# Altium project Platforma.PrjPcb
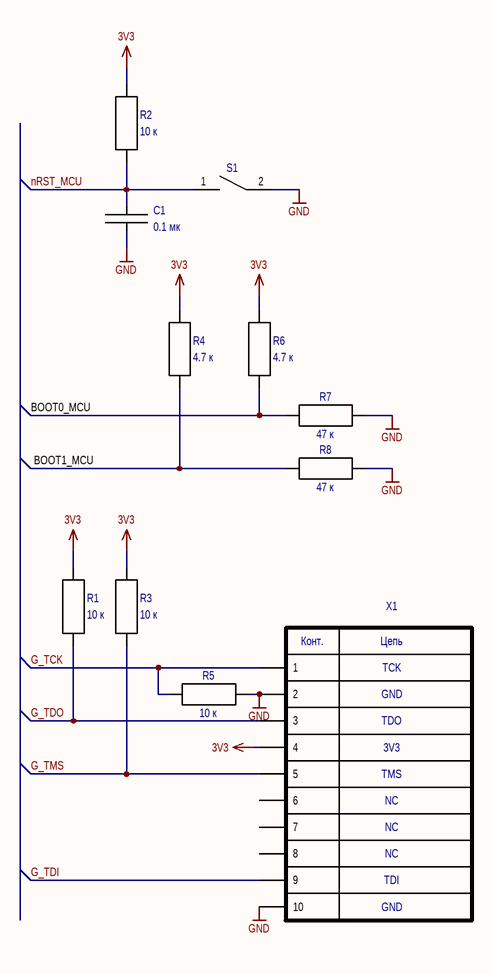
[diagram p0: служебный.SchDoc]
6 sheets, 181 parts. Net scope: global (net labels, ports and power ports of the same name join across sheets).
Board file: platforma.PcbDoc
Sheets:
  служебный.SchDoc
  мезанин.SchDoc
  GPIO_mcu_plis.SchDoc
  периферия.SchDoc
  программатор_мк.SchDoc
  программатор_ПЛИС.SchDoc

## Sheet служебный.SchDoc
size 420 x 297 mm; SheetNumber: 1; SheetTotal: 6

### Parts
C1  value 0.1 мк  (hidden comment: 0.1 мкФ ±* * * *, *)
R1  value 10 к
R2  value 10 к
R3  value 10 к
R4  value 4.7 к
R5  value 10 к
R6  value 4.7 к
R7  value 47 к
R8  value 47 к
S1  Тактильный переключатель KLS7-TS6604-4.3-180-B KLS  (value not drawn)
X1  1: GND  2: 3V3  4: TMS  6: TCK  8: TDO  10: TDI  12: NC  (hidden comment: KONT_POLE_JTAG14)

### Nets
3V3: R1.1 R2.1 R3.1 R4.1 R6.1 X1.4
GND: C1.1 R5.2 R7.2 R8.2 S1.2 X1.2 X1.10
BOOT0_MCU: R6.2 R7.1
BOOT1_MCU: R4.2 R8.1
G_TCK: R5.1 X1.1
G_TDI: X1.9
G_TDO: R1.2 X1.3
G_TMS: R3.2 X1.5
nRST_MCU: C1.2 R2.2 S1.1

Not connected (* = marked no-connect by the designer): X1 6 7 8

### Notes on the sheet
- Перв.примен.
- Справ. №
- Подп. и дата
- Инв.№ дубл.
- Взам. инв. №
- Изм.
- Лист
- № докум.
- Подп.
- Дата
- Лит.
- Масса
- Масштаб
- Пров.
- Т.контр
- Разраб.
- Схема электрическая принципиальная
- 1
- Листов
- Инв № подл.
- Н.контр.
- Утв.
- Копировал
- Формат А3
- (in symbol KONT_POLE_JTAG10) Конт.; Цепь

### Library data of the parts
C1 = C: Company: *; PartNumber: *; Tolerance: *; Voltage: *; Type: *; Package: *
R1-R8 = R_1: Company: *; PartNumber: *; Package: *; Tolerance: *
S1 = BTN: Company: KLS; PartNumber: KLS7-TS6604-4.3-180-B
X1 = KONT_POLE_JTAG10: 14: NC; 5: NC; 9: GND

## Sheet мезанин.SchDoc
size 420 x 297 mm; SheetNumber: 2; SheetTotal: 6
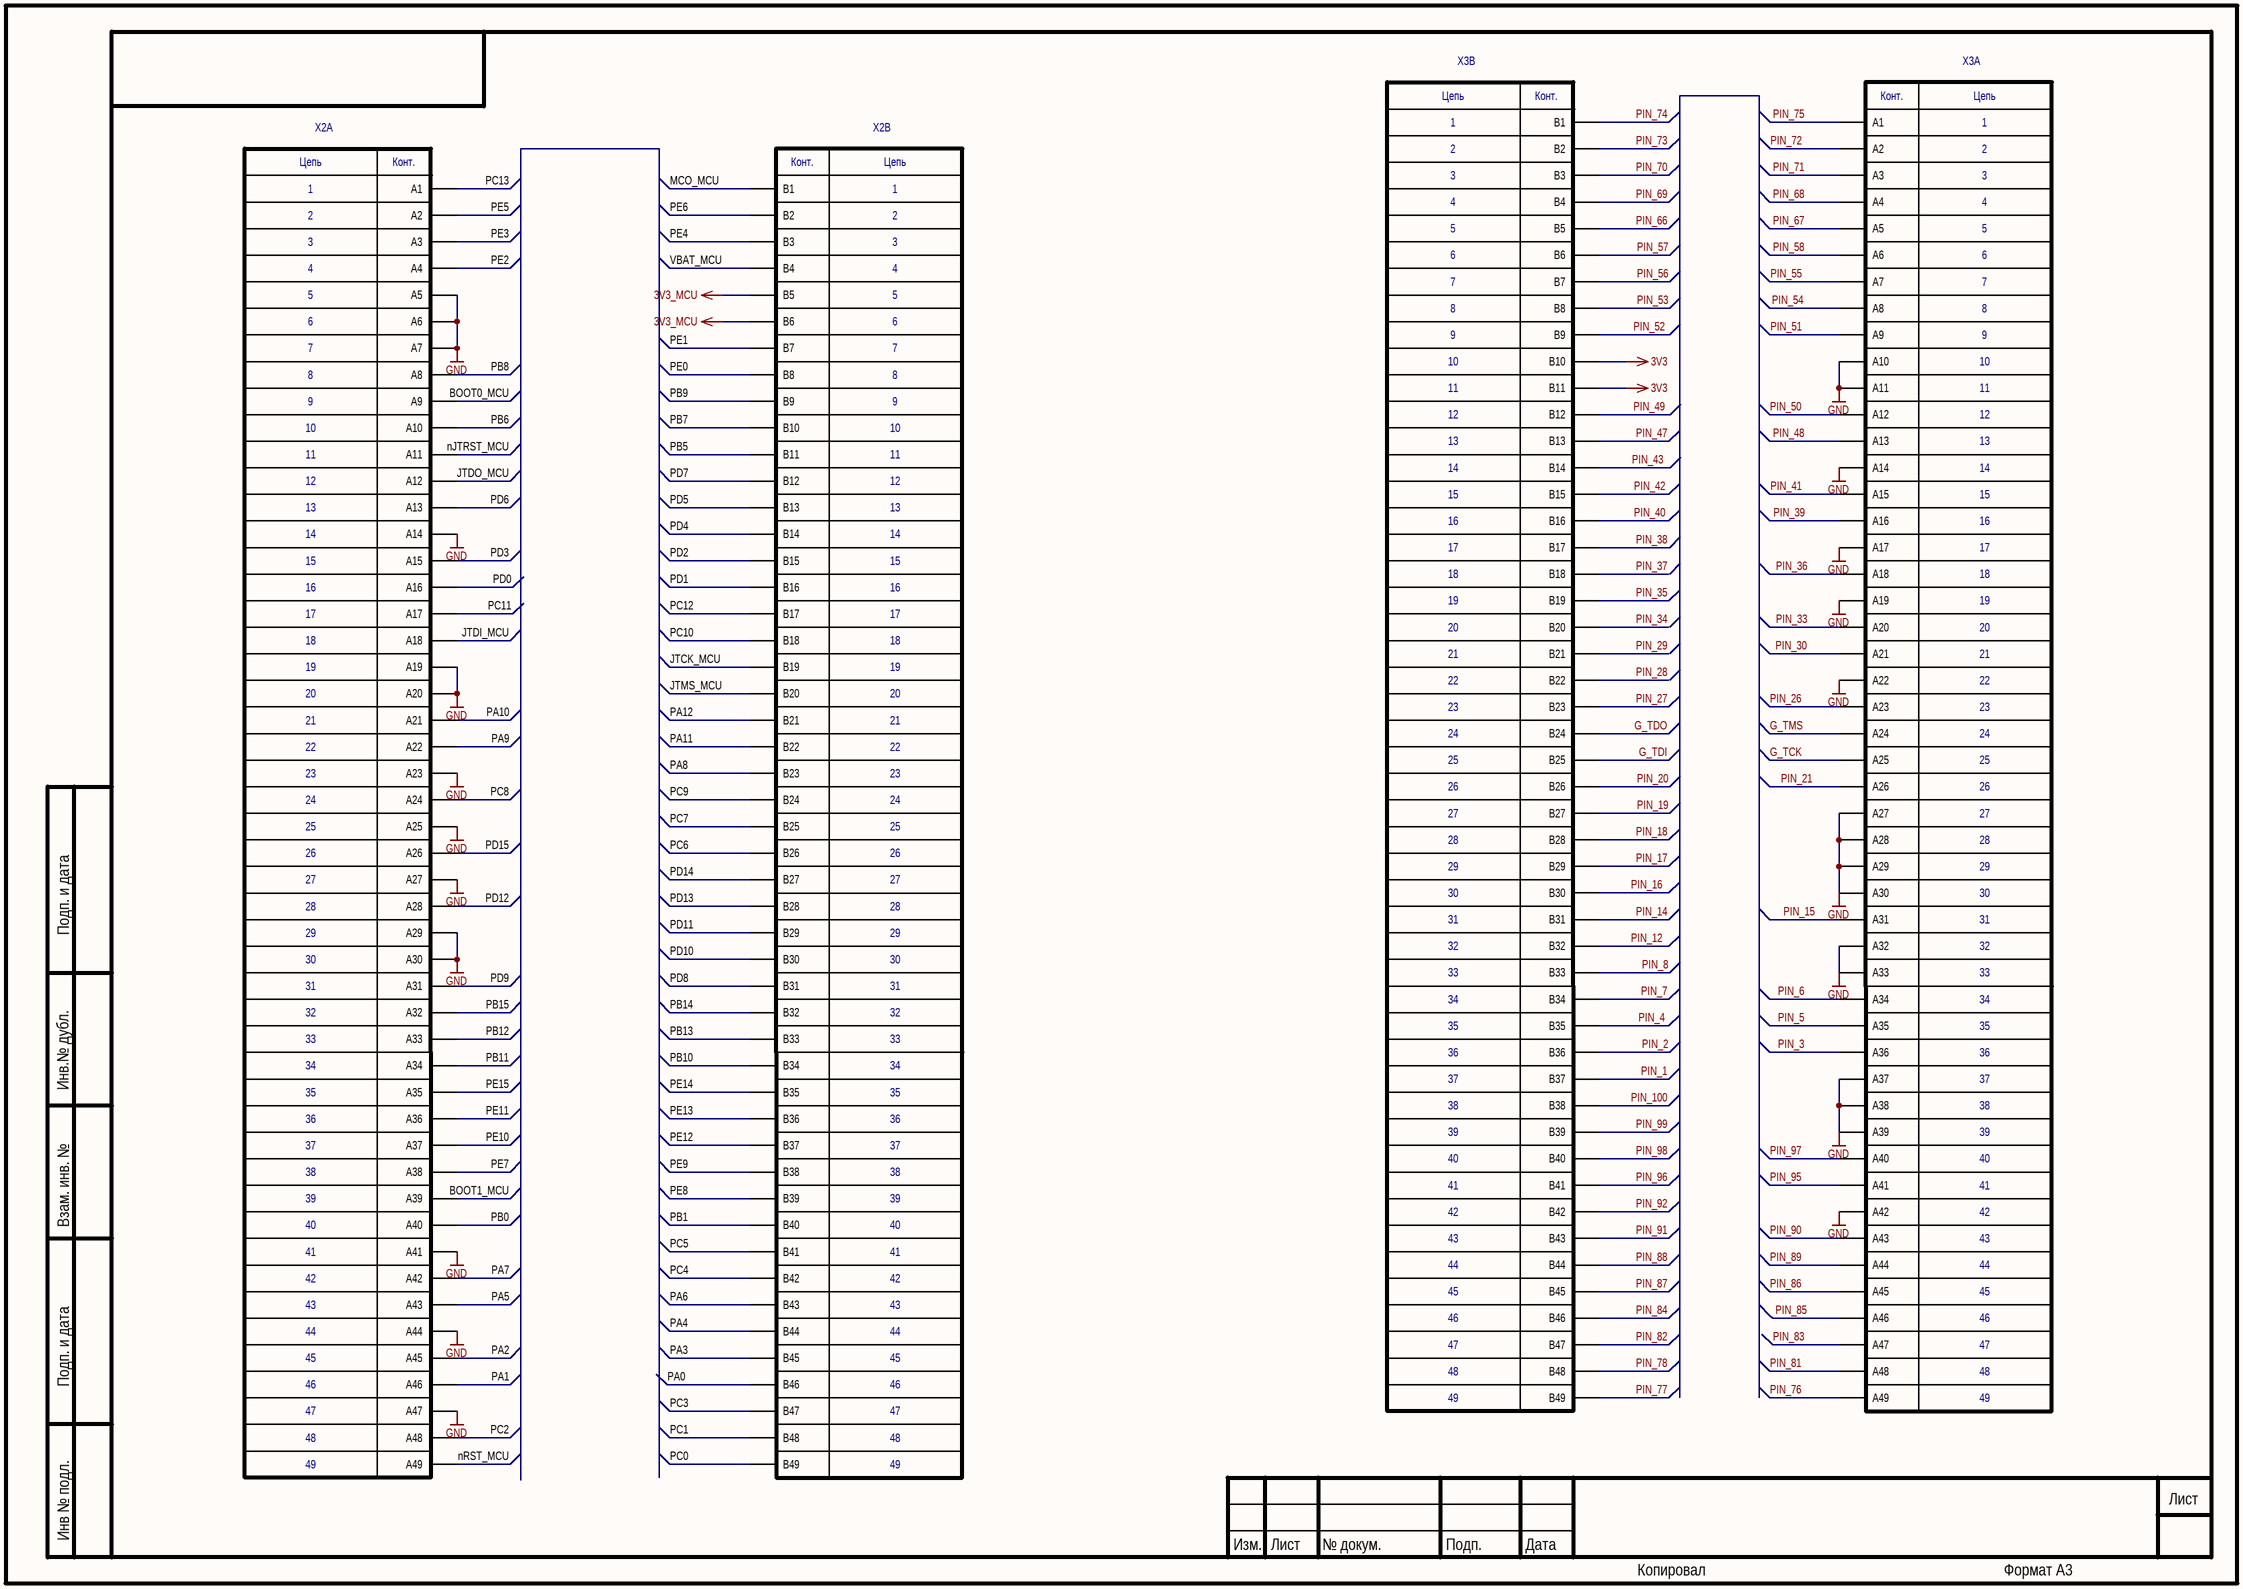
[diagram p1: мезанин.SchDoc]

### Parts
X2  KONT_POLE_MEZ  [3113-112T]  (value not drawn)  (parts A,B of 2)
X3  KONT_POLE_MEZ  [3113-112T]  (value not drawn)  (parts A,B of 2)

### Nets
3V3: X3.B10 X3.B11
3V3_MCU: X2.B5 X2.B6
GND: X2.A5 X2.A6 X2.A7 X2.A14 X2.A19 X2.A20 X2.A23 X2.A25 X2.A27 X2.A29 X2.A30 X2.A41 X2.A44 X2.A47 X3.A10 X3.A11 X3.A14 X3.A17 X3.A19 X3.A22 X3.A27 X3.A28 X3.A29 X3.A30 X3.A32 X3.A33 X3.A37 X3.A38 X3.A39 X3.A42
BOOT0_MCU: X2.A9
BOOT1_MCU: X2.A39
G_TCK: X3.A25
G_TDI: X3.B25
G_TDO: X3.B24
G_TMS: X3.A24
JTCK_MCU: X2.B19
JTDI_MCU: X2.A18
JTDO_MCU: X2.A12
JTMS_MCU: X2.B20
MCO_MCU: X2.B1
nJTRST_MCU: X2.A11
nRST_MCU: X2.A49
PA0: X2.B46
PA1: X2.A46
PA2: X2.A45
PA3: X2.B45
PA4: X2.B44
PA5: X2.A43
PA6: X2.B43
PA7: X2.A42
PA8: X2.B23
PA9: X2.A22
PA10: X2.A21
PA11: X2.B22
PA12: X2.B21
PB0: X2.A40
PB1: X2.B40
PB5: X2.B11
PB6: X2.A10
PB7: X2.B10
PB8: X2.A8
PB9: X2.B9
PB10: X2.B34
PB11: X2.A34
PB12: X2.A33
PB13: X2.B33
PB14: X2.B32
PB15: X2.A32
PC0: X2.B49
PC1: X2.B48
PC2: X2.A48
PC3: X2.B47
PC4: X2.B42
PC5: X2.B41
PC6: X2.B26
PC7: X2.B25
PC8: X2.A24
PC9: X2.B24
PC10: X2.B18
PC11: X2.A17
PC12: X2.B17
PC13: X2.A1
PD0: X2.A16
PD1: X2.B16
PD2: X2.B15
PD3: X2.A15
PD4: X2.B14
PD5: X2.B13
PD6: X2.A13
PD7: X2.B12
PD8: X2.B31
PD9: X2.A31
PD10: X2.B30
PD11: X2.B29
PD12: X2.A28
PD13: X2.B28
PD14: X2.B27
PD15: X2.A26
PE0: X2.B8
PE1: X2.B7
PE2: X2.A4
PE3: X2.A3
PE4: X2.B3
PE5: X2.A2
PE6: X2.B2
PE7: X2.A38
PE8: X2.B39
PE9: X2.B38
PE10: X2.A37
PE11: X2.A36
PE12: X2.B37
PE13: X2.B36
PE14: X2.B35
PE15: X2.A35
PIN_1: X3.B37
PIN_2: X3.B36
PIN_3: X3.A36
PIN_4: X3.B35
PIN_5: X3.A35
PIN_6: X3.A34
PIN_7: X3.B34
PIN_8: X3.B33
PIN_12: X3.B32
PIN_14: X3.B31
PIN_15: X3.A31
PIN_16: X3.B30
PIN_17: X3.B29
PIN_18: X3.B28
PIN_19: X3.B27
PIN_20: X3.B26
PIN_21: X3.A26
PIN_26: X3.A23
PIN_27: X3.B23
PIN_28: X3.B22
PIN_29: X3.B21
PIN_30: X3.A21
PIN_33: X3.A20
PIN_34: X3.B20
PIN_35: X3.B19
PIN_36: X3.A18
PIN_37: X3.B18
PIN_38: X3.B17
PIN_39: X3.A16
PIN_40: X3.B16
PIN_41: X3.A15
PIN_42: X3.B15
PIN_43: X3.B14
PIN_47: X3.B13
PIN_48: X3.A13
PIN_49: X3.B12
PIN_50: X3.A12
PIN_51: X3.A9
PIN_52: X3.B9
PIN_53: X3.B8
PIN_54: X3.A8
PIN_55: X3.A7
PIN_56: X3.B7
PIN_57: X3.B6
PIN_58: X3.A6
PIN_66: X3.B5
PIN_67: X3.A5
PIN_68: X3.A4
PIN_69: X3.B4
PIN_70: X3.B3
PIN_71: X3.A3
PIN_72: X3.A2
PIN_73: X3.B2
PIN_74: X3.B1
PIN_75: X3.A1
PIN_76: X3.A49
PIN_77: X3.B49
PIN_78: X3.B48
PIN_81: X3.A48
PIN_82: X3.B47
PIN_83: X3.A47
PIN_84: X3.B46
PIN_85: X3.A46
PIN_86: X3.A45
PIN_87: X3.B45
PIN_88: X3.B44
PIN_89: X3.A44
PIN_90: X3.A43
PIN_91: X3.B43
PIN_92: X3.B42
PIN_95: X3.A41
PIN_96: X3.B41
PIN_97: X3.A40
PIN_98: X3.B40
PIN_99: X3.B39
PIN_100: X3.B38
VBAT_MCU: X2.B4

### Notes on the sheet
- Подп. и дата
- Инв.№ дубл.
- Взам. инв. №
- Инв № подл.
- Изм.
- Лист
- № докум.
- Подп.
- Дата
- Копировал
- Формат А3
- (in symbol 3113-112T, part A) Конт.; Цепь; 1; 2; 3; 4; 5; 6; 7; 8; 9; 10; 11; 12; 13; 14; 15; 16; 17; 18; 19; 20; 21; 22; 23; 24; 25; 26; 27; 28; 29; 30; 31; 32; 33; 34; 35; 36; 37; 38; 39; 40; 41; 42; 43; 44; 45; 46; 47; 48; 49
- (in symbol 3113-112T, part B) Цепь; Конт.; 1; 2; 3; 4; 5; 6; 7; 8; 9; 10; 11; 12; 13; 14; 15; 16; 17; 18; 19; 20; 21; 22; 23; 24; 25; 26; 27; 28; 29; 30; 31; 32; 33; 34; 35; 36; 37; 38; 39; 40; 41; 42; 43; 44; 45; 46; 47; 48; 49

### Library data of the parts
X2 X3 = 3113-112T

## Sheet GPIO_mcu_plis.SchDoc
size 420 x 297 mm; SheetNumber: 3; SheetTotal: 6
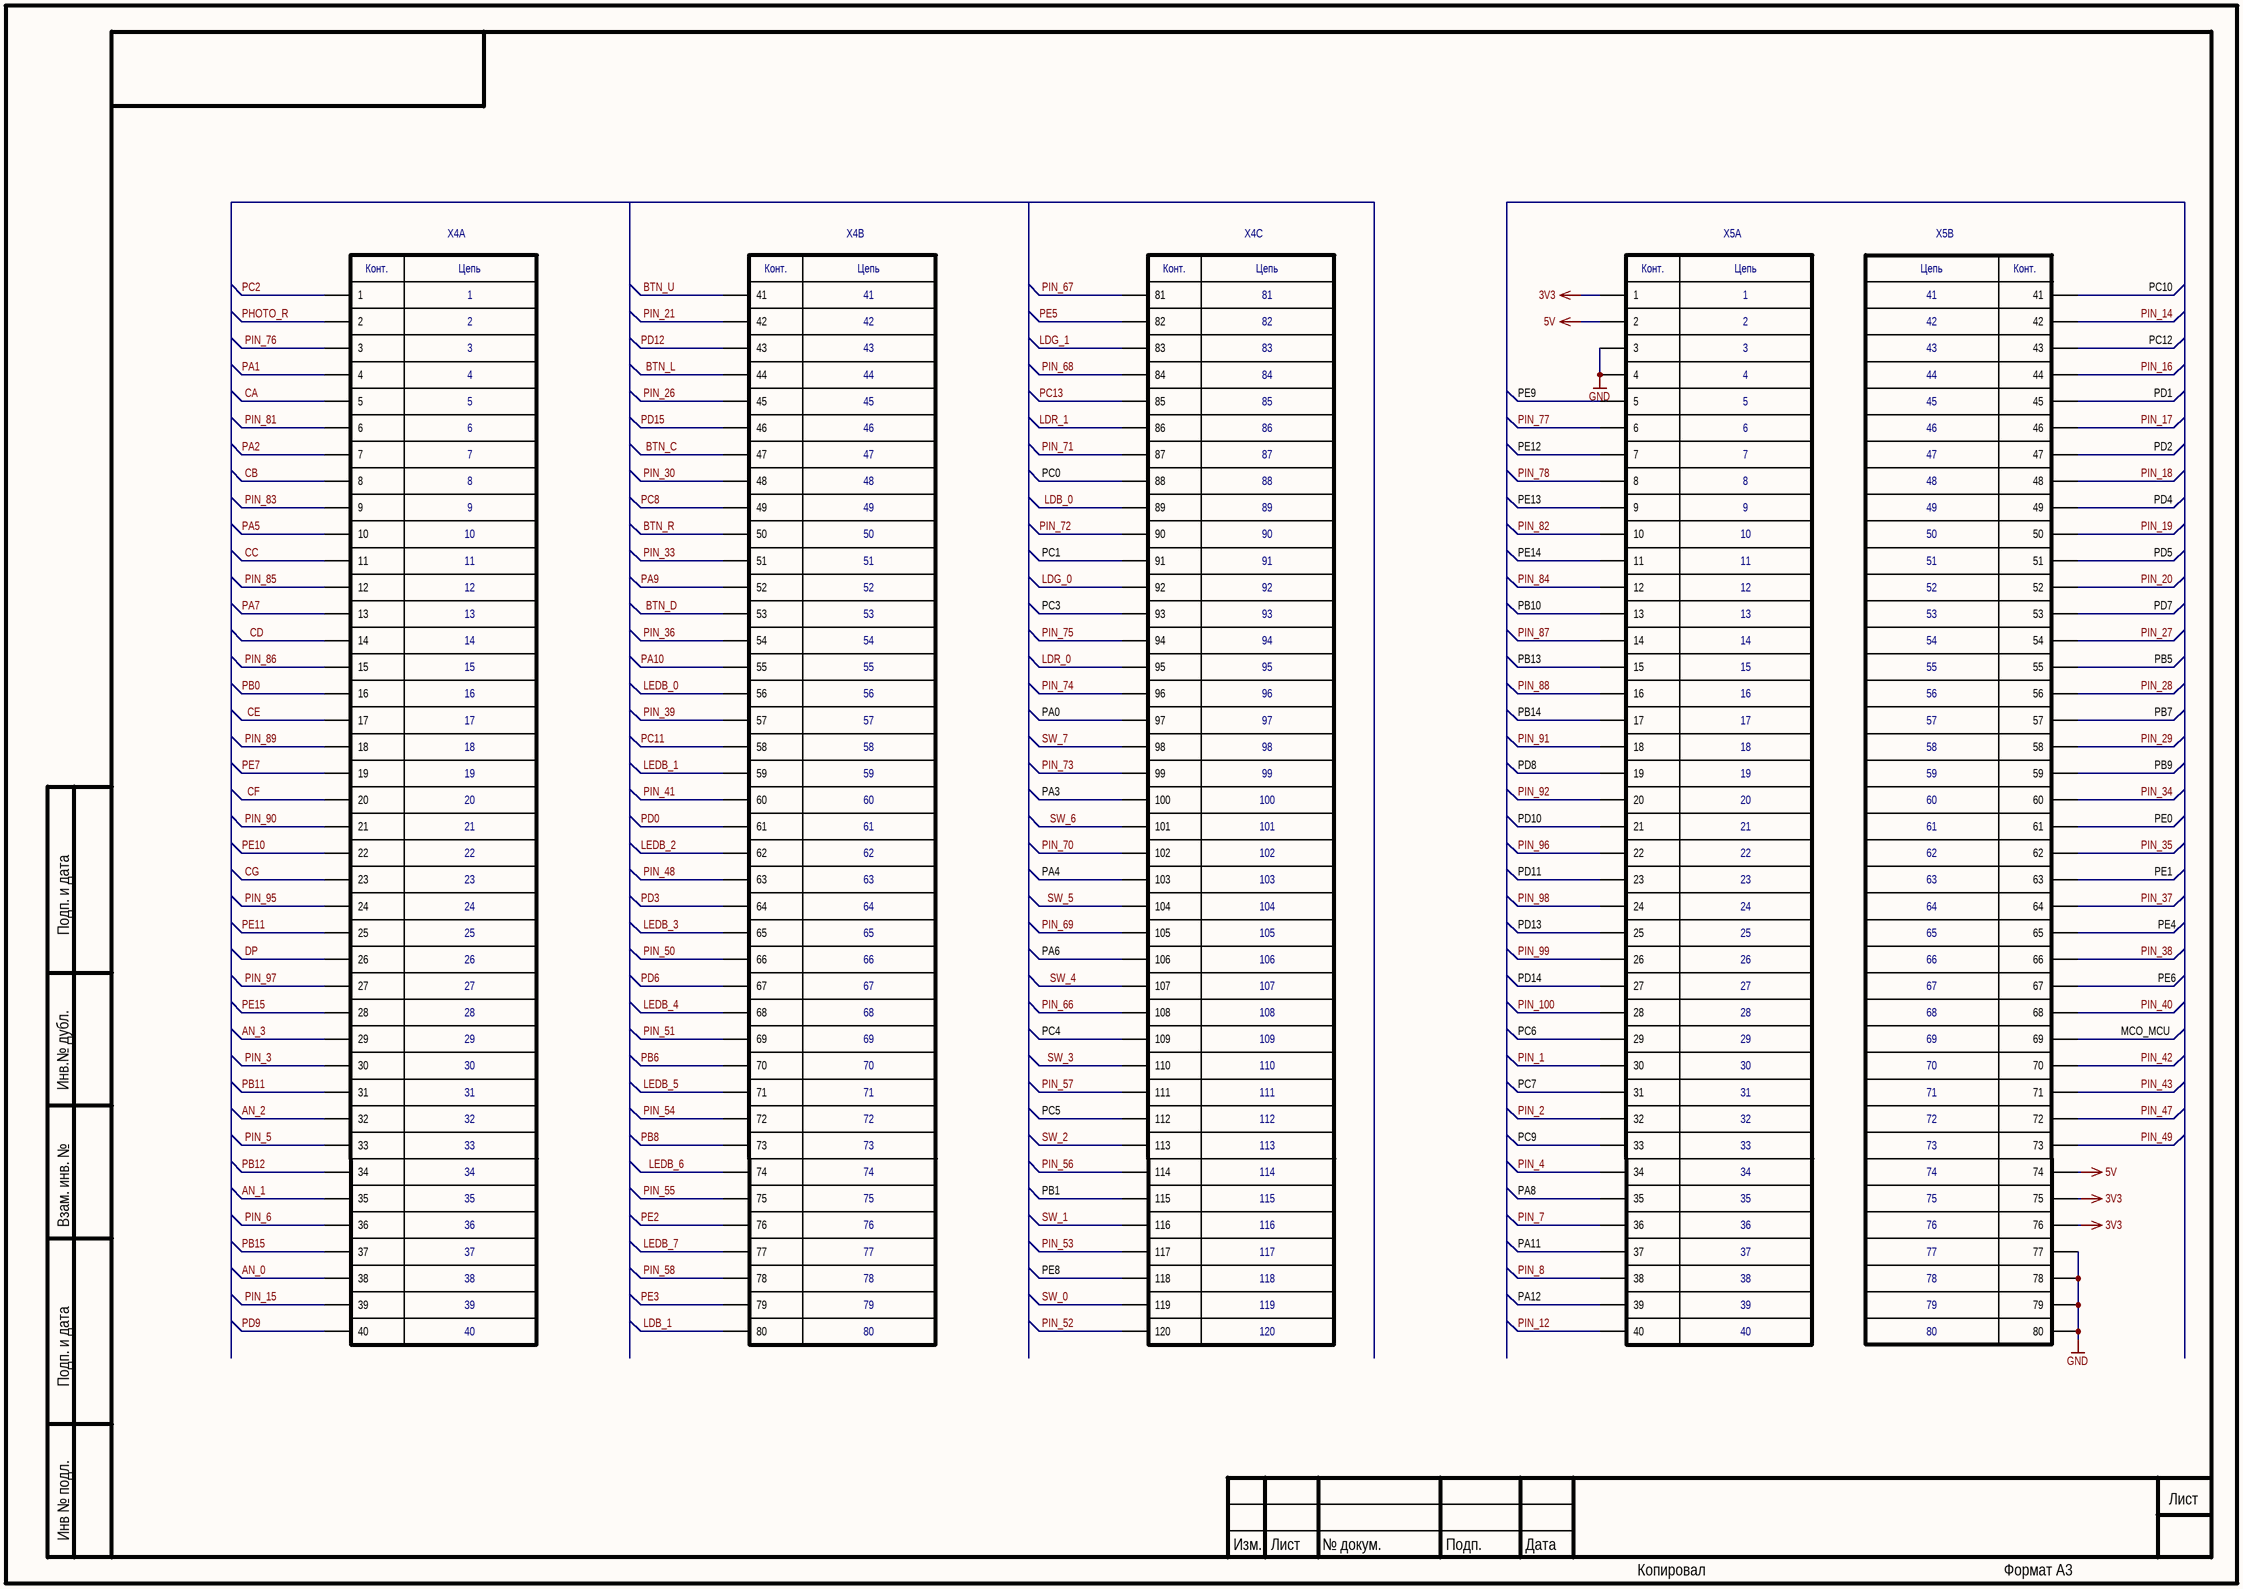
[diagram p2: GPIO_mcu_plis.SchDoc]

### Parts
X4  KONT_POLE_MEZ  [PLT-120]  (value not drawn)  (parts A,B,C of 3)
X5  KONT_POLE_MEZ  [PLD-80]  (value not drawn)  (parts A,B of 2)

### Nets
3V3: X5.1 X5.75 X5.76
5V: X5.2 X5.74
GND: X5.3 X5.4 X5.77 X5.78 X5.79 X5.80
AN_0: X4.38
AN_1: X4.35
AN_2: X4.32
AN_3: X4.29
BTN_C: X4.47
BTN_D: X4.53
BTN_L: X4.44
BTN_R: X4.50
BTN_U: X4.41
CA: X4.5
CB: X4.8
CC: X4.11
CD: X4.14
CE: X4.17
CF: X4.20
CG: X4.23
DP: X4.26
LDB_0: X4.89
LDB_1: X4.80
LDG_0: X4.92
LDG_1: X4.83
LDR_0: X4.95
LDR_1: X4.86
LEDB_0: X4.56
LEDB_1: X4.59
LEDB_2: X4.62
LEDB_3: X4.65
LEDB_4: X4.68
LEDB_5: X4.71
LEDB_6: X4.74
LEDB_7: X4.77
MCO_MCU: X5.69
PA0: X4.97
PA1: X4.4
PA2: X4.7
PA3: X4.100
PA4: X4.103
PA5: X4.10
PA6: X4.106
PA7: X4.13
PA8: X5.35
PA9: X4.52
PA10: X4.55
PA11: X5.37
PA12: X5.39
PB0: X4.16
PB1: X4.115
PB5: X5.55
PB6: X4.70
PB7: X5.57
PB8: X4.73
PB9: X5.59
PB10: X5.13
PB11: X4.31
PB12: X4.34
PB13: X5.15
PB14: X5.17
PB15: X4.37
PC0: X4.88
PC1: X4.91
PC2: X4.1
PC3: X4.93
PC4: X4.109
PC5: X4.112
PC6: X5.29
PC7: X5.31
PC8: X4.49
PC9: X5.33
PC10: X5.41
PC11: X4.58
PC12: X5.43
PC13: X4.85
PD0: X4.61
PD1: X5.45
PD2: X5.47
PD3: X4.64
PD4: X5.49
PD5: X5.51
PD6: X4.67
PD7: X5.53
PD8: X5.19
PD9: X4.40
PD10: X5.21
PD11: X5.23
PD12: X4.43
PD13: X5.25
PD14: X5.27
PD15: X4.46
PE0: X5.61
PE1: X5.63
PE2: X4.76
PE3: X4.79
PE4: X5.65
PE5: X4.82
PE6: X5.67
PE7: X4.19
PE8: X4.118
PE9: X5.5
PE10: X4.22
PE11: X4.25
PE12: X5.7
PE13: X5.9
PE14: X5.11
PE15: X4.28
PHOTO_R: X4.2
PIN_1: X5.30
PIN_2: X5.32
PIN_3: X4.30
PIN_4: X5.34
PIN_5: X4.33
PIN_6: X4.36
PIN_7: X5.36
PIN_8: X5.38
PIN_12: X5.40
PIN_14: X5.42
PIN_15: X4.39
PIN_16: X5.44
PIN_17: X5.46
PIN_18: X5.48
PIN_19: X5.50
PIN_20: X5.52
PIN_21: X4.42
PIN_26: X4.45
PIN_27: X5.54
PIN_28: X5.56
PIN_29: X5.58
PIN_30: X4.48
PIN_33: X4.51
PIN_34: X5.60
PIN_35: X5.62
PIN_36: X4.54
PIN_37: X5.64
PIN_38: X5.66
PIN_39: X4.57
PIN_40: X5.68
PIN_41: X4.60
PIN_42: X5.70
PIN_43: X5.71
PIN_47: X5.72
PIN_48: X4.63
PIN_49: X5.73
PIN_50: X4.66
PIN_51: X4.69
PIN_52: X4.120
PIN_53: X4.117
PIN_54: X4.72
PIN_55: X4.75
PIN_56: X4.114
PIN_57: X4.111
PIN_58: X4.78
PIN_66: X4.108
PIN_67: X4.81
PIN_68: X4.84
PIN_69: X4.105
PIN_70: X4.102
PIN_71: X4.87
PIN_72: X4.90
PIN_73: X4.99
PIN_74: X4.96
PIN_75: X4.94
PIN_76: X4.3
PIN_77: X5.6
PIN_78: X5.8
PIN_81: X4.6
PIN_82: X5.10
PIN_83: X4.9
PIN_84: X5.12
PIN_85: X4.12
PIN_86: X4.15
PIN_87: X5.14
PIN_88: X5.16
PIN_89: X4.18
PIN_90: X4.21
PIN_91: X5.18
PIN_92: X5.20
PIN_95: X4.24
PIN_96: X5.22
PIN_97: X4.27
PIN_98: X5.24
PIN_99: X5.26
PIN_100: X5.28
SW_0: X4.119
SW_1: X4.116
SW_2: X4.113
SW_3: X4.110
SW_4: X4.107
SW_5: X4.104
SW_6: X4.101
SW_7: X4.98

### Notes on the sheet
- Подп. и дата
- Инв.№ дубл.
- Взам. инв. №
- Инв № подл.
- Изм.
- Лист
- № докум.
- Подп.
- Дата
- Копировал
- Формат А3
- (in symbol KONT_POLE_80, part A) Конт.; Цепь
- (in symbol KONT_POLE_80, part B) Цепь; Конт.
- (in symbol KONT_POLE_120, part A) Конт.; Цепь
- (in symbol KONT_POLE_120, part B) Конт.; Цепь
- (in symbol KONT_POLE_120, part C) Конт.; Цепь

### Library data of the parts
X4 = KONT_POLE_120
X5 = KONT_POLE_80

## Sheet периферия.SchDoc
size 420 x 297 mm; SheetNumber: 4; SheetTotal: 6
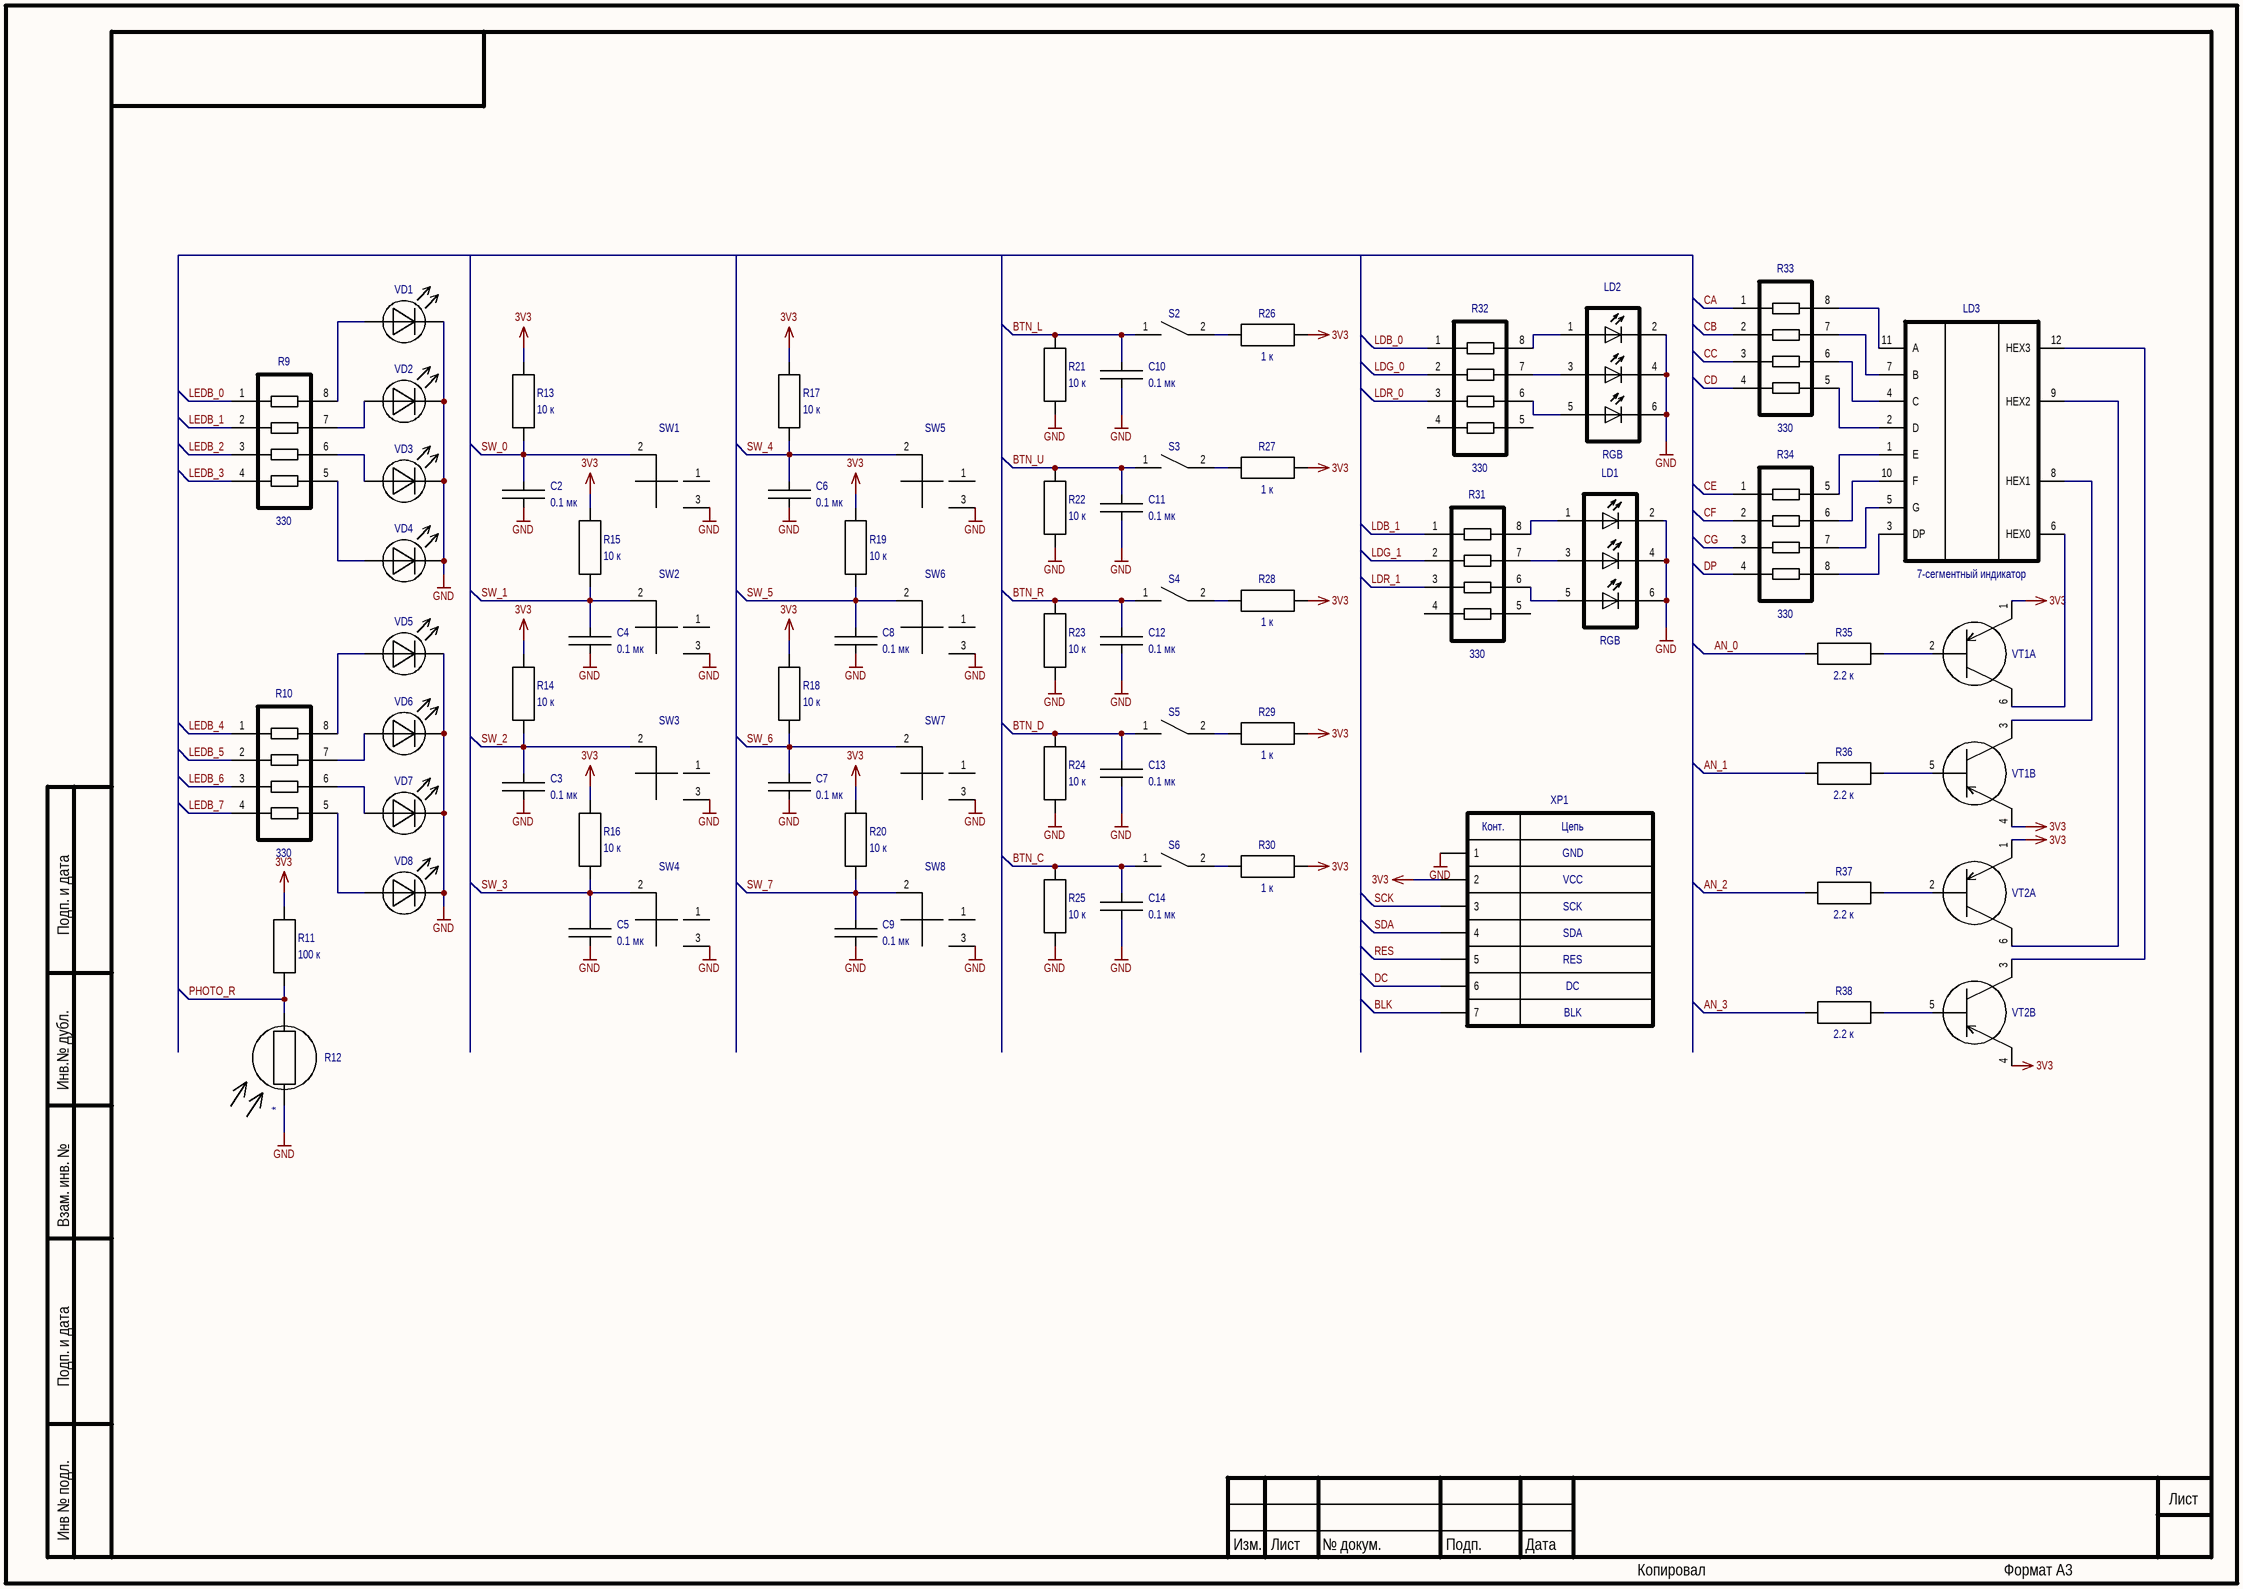
[diagram p3: периферия.SchDoc]

### Parts
C2  value 0.1 мк  [C0603]  (hidden comment: 0.1 мкФ ±* * * *, *)
C3  value 0.1 мк  [C0603]  (hidden comment: 0.1 мкФ ±* * * *, *)
C4  value 0.1 мк  [C0603]  (hidden comment: 0.1 мкФ ±* * * *, *)
C5  value 0.1 мк  [C0603]  (hidden comment: 0.1 мкФ ±* * * *, *)
C6  value 0.1 мк  [C0603]  (hidden comment: 0.1 мкФ ±* * * *, *)
C7  value 0.1 мк  [C0603]  (hidden comment: 0.1 мкФ ±* * * *, *)
C8  value 0.1 мк  [C0603]  (hidden comment: 0.1 мкФ ±* * * *, *)
C9  value 0.1 мк  [C0603]  (hidden comment: 0.1 мкФ ±* * * *, *)
C10  value 0.1 мк  [C0603]  (hidden comment: 0.1 мкФ ±* * * *, *)
C11  value 0.1 мк  [C0603]  (hidden comment: 0.1 мкФ ±* * * *, *)
C12  value 0.1 мк  [C0603]  (hidden comment: 0.1 мкФ ±* * * *, *)
C13  value 0.1 мк  [C0603]  (hidden comment: 0.1 мкФ ±* * * *, *)
C14  value 0.1 мк  [C0603]  (hidden comment: 0.1 мкФ ±* * * *, *)
LD1  RGB  [LED_150352M173300]
LD2  RGB  [LED_150352M173300]
LD3  value 7-сегментный индикатор  [PLD-12]  (hidden comment: 4042AS (TSOT-23) Linear Technology)
R9  330  [RESCAXE80P320X160X70-8N]
R10  330  [RESCAXE80P320X160X70-8N]
R11  value 100 к  [P1-12-0.1(0603)]
R12  (no value)  [PHODET_PDV-P8103]
R13  value 10 к  [P1-12-0.1(0603)]
R14  value 10 к  [P1-12-0.1(0603)]
R15  value 10 к  [P1-12-0.1(0603)]
R16  value 10 к  [P1-12-0.1(0603)]
R17  value 10 к  [P1-12-0.1(0603)]
R18  value 10 к  [P1-12-0.1(0603)]
R19  value 10 к  [P1-12-0.1(0603)]
R20  value 10 к  [P1-12-0.1(0603)]
R21  value 10 к  [P1-12-0.1(0603)]
R22  value 10 к  [P1-12-0.1(0603)]
R23  value 10 к  [P1-12-0.1(0603)]
R24  value 10 к  [P1-12-0.1(0603)]
R25  value 10 к  [P1-12-0.1(0603)]
R26  value 1 к  [P1-12-0.1(0603)]
R27  value 1 к  [P1-12-0.1(0603)]
R28  value 1 к  [P1-12-0.1(0603)]
R29  value 1 к  [P1-12-0.1(0603)]
R30  value 1 к  [P1-12-0.1(0603)]
R31  330  [RESCAXE80P320X160X70-8N]
R32  330  [RESCAXE80P320X160X70-8N]
R33  330  [RESCAXE80P320X160X70-8N]
R34  330  [RESCAXE80P320X160X70-8N]
R35  value 2.2 к  [P1-12-0.1(0603)]
R36  value 2.2 к  [P1-12-0.1(0603)]
R37  value 2.2 к  [P1-12-0.1(0603)]
R38  value 2.2 к  [P1-12-0.1(0603)]
S2  Тактильный переключатель KLS7-TS6604-4.3-180-B KLS  [SW_1825910-6-4]  (value not drawn)
S3  Тактильный переключатель KLS7-TS6604-4.3-180-B KLS  [SW_1825910-6-4]  (value not drawn)
S4  Тактильный переключатель KLS7-TS6604-4.3-180-B KLS  [SW_1825910-6-4]  (value not drawn)
S5  Тактильный переключатель KLS7-TS6604-4.3-180-B KLS  [SW_1825910-6-4]  (value not drawn)
S6  Тактильный переключатель KLS7-TS6604-4.3-180-B KLS  [SW_1825910-6-4]  (value not drawn)
SW1  SW_two  [MSS-22D18 MSS22D18G2]  (value not drawn)
SW2  SW_two  [MSS-22D18 MSS22D18G2]  (value not drawn)
SW3  SW_two  [MSS-22D18 MSS22D18G2]  (value not drawn)
SW4  SW_two  [MSS-22D18 MSS22D18G2]  (value not drawn)
SW5  SW_two  [MSS-22D18 MSS22D18G2]  (value not drawn)
SW6  SW_two  [MSS-22D18 MSS22D18G2]  (value not drawn)
SW7  SW_two  [MSS-22D18 MSS22D18G2]  (value not drawn)
SW8  SW_two  [MSS-22D18 MSS22D18G2]  (value not drawn)
VD1  Светодиод  [LED 0603]  (value not drawn)
VD2  Светодиод  [LED 0603]  (value not drawn)
VD3  Светодиод  [LED 0603]  (value not drawn)
VD4  Светодиод  [LED 0603]  (value not drawn)
VD5  Светодиод  [LED 0603]  (value not drawn)
VD6  Светодиод  [LED 0603]  (value not drawn)
VD7  Светодиод  [LED 0603]  (value not drawn)
VD8  Светодиод  [LED 0603]  (value not drawn)
VT1  2Т3129А9 (КТ-46А) АО.336.448ТУ / 02  [SOT-363]  (value not drawn)  (parts A,B of 2)
VT2  2Т3129А9 (КТ-46А) АО.336.448ТУ / 02  [SOT-363]  (value not drawn)  (parts A,B of 2)
XP1  2: VCC  1: GND  4: SDA  5: RES  6: DC  8: SCK  7: BLK  [PBS-7]  (hidden comment: KONT_POLE_8)

### Nets
3V3: R11.2 R13.1 R14.1 R15.1 R16.1 R17.1 R18.1 R19.1 R20.1 R26.2 R27.2 R28.2 R29.2 R30.2 VT1.1(E) VT1.4(E) VT2.1(E) VT2.4(E) XP1.2
GND: C2.1 C3.1 C4.1 C5.1 C6.1 C7.1 C8.1 C9.1 C10.1 C11.1 C12.1 C13.1 C14.1 LD1.2(B) LD1.4(R) LD1.6(G) LD2.2(B) LD2.4(R) LD2.6(G) R12.1 R21.2 R22.2 R23.2 R24.2 R25.2 SW1.3 SW2.3 SW3.3 SW4.3 SW5.3 SW6.3 SW7.3 SW8.3 VD1.2(C) VD2.2(C) VD3.2(C) VD4.2(C) VD5.2(C) VD6.2(C) VD7.2(C) VD8.2(C) XP1.1
AN_0: R35.2
AN_1: R36.2
AN_2: R37.2
AN_3: R38.2
BLK: XP1.7
BTN_C: C14.2 R25.1 S6.1
BTN_D: C13.2 R24.1 S5.1
BTN_L: C10.2 R21.1 S2.1
BTN_R: C12.2 R23.1 S4.1
BTN_U: C11.2 R22.1 S3.1
CA: R33.1(B)
CB: R33.2(B)
CC: R33.3(B)
CD: R33.4(B)
CE: R34.1(B)
CF: R34.2(B)
CG: R34.3(B)
DC: XP1.6
DP: R34.4(B)
LDB_0: R32.1(B)
LDB_1: R31.1(B)
LDG_0: R32.2(B)
LDG_1: R31.2(B)
LDR_0: R32.3(B)
LDR_1: R31.3(B)
LEDB_0: R9.1(B)
LEDB_1: R9.2(B)
LEDB_2: R9.3(B)
LEDB_3: R9.4(B)
LEDB_4: R10.1(B)
LEDB_5: R10.2(B)
LEDB_6: R10.3(B)
LEDB_7: R10.4(B)
PHOTO_R: R11.1 R12.2
RES: XP1.5
SCK: XP1.3
SDA: XP1.4
SW_0: C2.2 R13.2 SW1.2
SW_1: C4.2 R15.2 SW2.2
SW_2: C3.2 R14.2 SW3.2
SW_3: C5.2 R16.2 SW4.2
SW_4: C6.2 R17.2 SW5.2
SW_5: C8.2 R19.2 SW6.2
SW_6: C7.2 R18.2 SW7.2
SW_7: C9.2 R20.2 SW8.2
NetLD1_1: LD1.1(B) R31.8(B)
NetLD1_3: LD1.3(R) R31.7(B)
NetLD1_5: LD1.5(G) R31.6(B)
NetLD2_1: LD2.1(B) R32.8(B)
NetLD2_3: LD2.3(R) R32.7(B)
NetLD2_5: LD2.5(G) R32.6(B)
NetLD3_1: LD3.1(E) R34.5(B)
NetLD3_2: LD3.2(D) R33.5(B)
NetLD3_3: LD3.3(DP) R34.8(B)
NetLD3_4: LD3.4(C) R33.6(B)
NetLD3_5: LD3.5(G) R34.7(B)
NetLD3_6: LD3.6(HEX0) VT1.6(K)
NetLD3_7: LD3.7(B) R33.7(B)
NetLD3_8: LD3.8(HEX1) VT1.3(K)
NetLD3_9: LD3.9(HEX2) VT2.6(K)
NetLD3_10: LD3.10(F) R34.6(B)
NetLD3_11: LD3.11(A) R33.8(B)
NetLD3_12: LD3.12(HEX3) VT2.3(K)
NetR9_5: R9.5(B) VD4.1(A)
NetR9_6: R9.6(B) VD3.1(A)
NetR9_7: R9.7(B) VD2.1(A)
NetR9_8: R9.8(B) VD1.1(A)
NetR10_5: R10.5(B) VD8.1(A)
NetR10_6: R10.6(B) VD7.1(A)
NetR10_7: R10.7(B) VD6.1(A)
NetR10_8: R10.8(B) VD5.1(A)
NetR26_1: R26.1 S2.2
NetR27_1: R27.1 S3.2
NetR28_1: R28.1 S4.2
NetR29_1: R29.1 S5.2
NetR30_1: R30.1 S6.2
NetR35_1: R35.1 VT1.2(B)
NetR36_1: R36.1 VT1.5(B)
NetR37_1: R37.1 VT2.2(B)
NetR38_1: R38.1 VT2.5(B)

Not connected (* = marked no-connect by the designer): R31 4(B) 5(B); R32 4(B) 5(B); SW1 1; SW2 1; SW3 1; SW4 1; SW5 1; SW6 1; SW7 1; SW8 1

### Notes on the sheet
- Подп. и дата
- Инв.№ дубл.
- Взам. инв. №
- Инв № подл.
- Изм.
- Лист
- № докум.
- Подп.
- Дата
- Копировал
- Формат А3
- (in symbol KONT_POLE_8_1) Конт.; Цепь

### Library data of the parts
C2-C14 = C: Company: *; PartNumber: *; Tolerance: *; Voltage: *; Type: *; Package: *
LD3 = 7-сегментный индикатор: Company: Linear Technology; PartNumber: 4042AS; Package: TSOT-23
R9 R10 R31-R33 = R330
R11 R26-R30 R35-R38 = R: Company: *; PartNumber: *; Package: *; Tolerance: *
R12 = R_3: Company: *; PartNumber: *; Package: *; Tolerance: *; Value: *
R13-R25 = R_1: Company: *; PartNumber: *; Package: *; Tolerance: *
R34 = R330: pin to pad: 5>8 6>7 7>6 8>5
S2-S6 = BTN: Company: KLS; PartNumber: KLS7-TS6604-4.3-180-B
VT1 VT2 = 2Т3129_1_1: NameCompany: Интеграл; Body: КТ-46А; TU: АО.336.448ТУ / 02; Value: 2Т3129А9; Family: Транзистор; PartNumber: 2Т3129А9; Name: 2Т3129А9
XP1 = KONT_POLE_8_1

## Sheet программатор_мк.SchDoc
size 420 x 297 mm; SheetNumber: 5; SheetTotal: 6
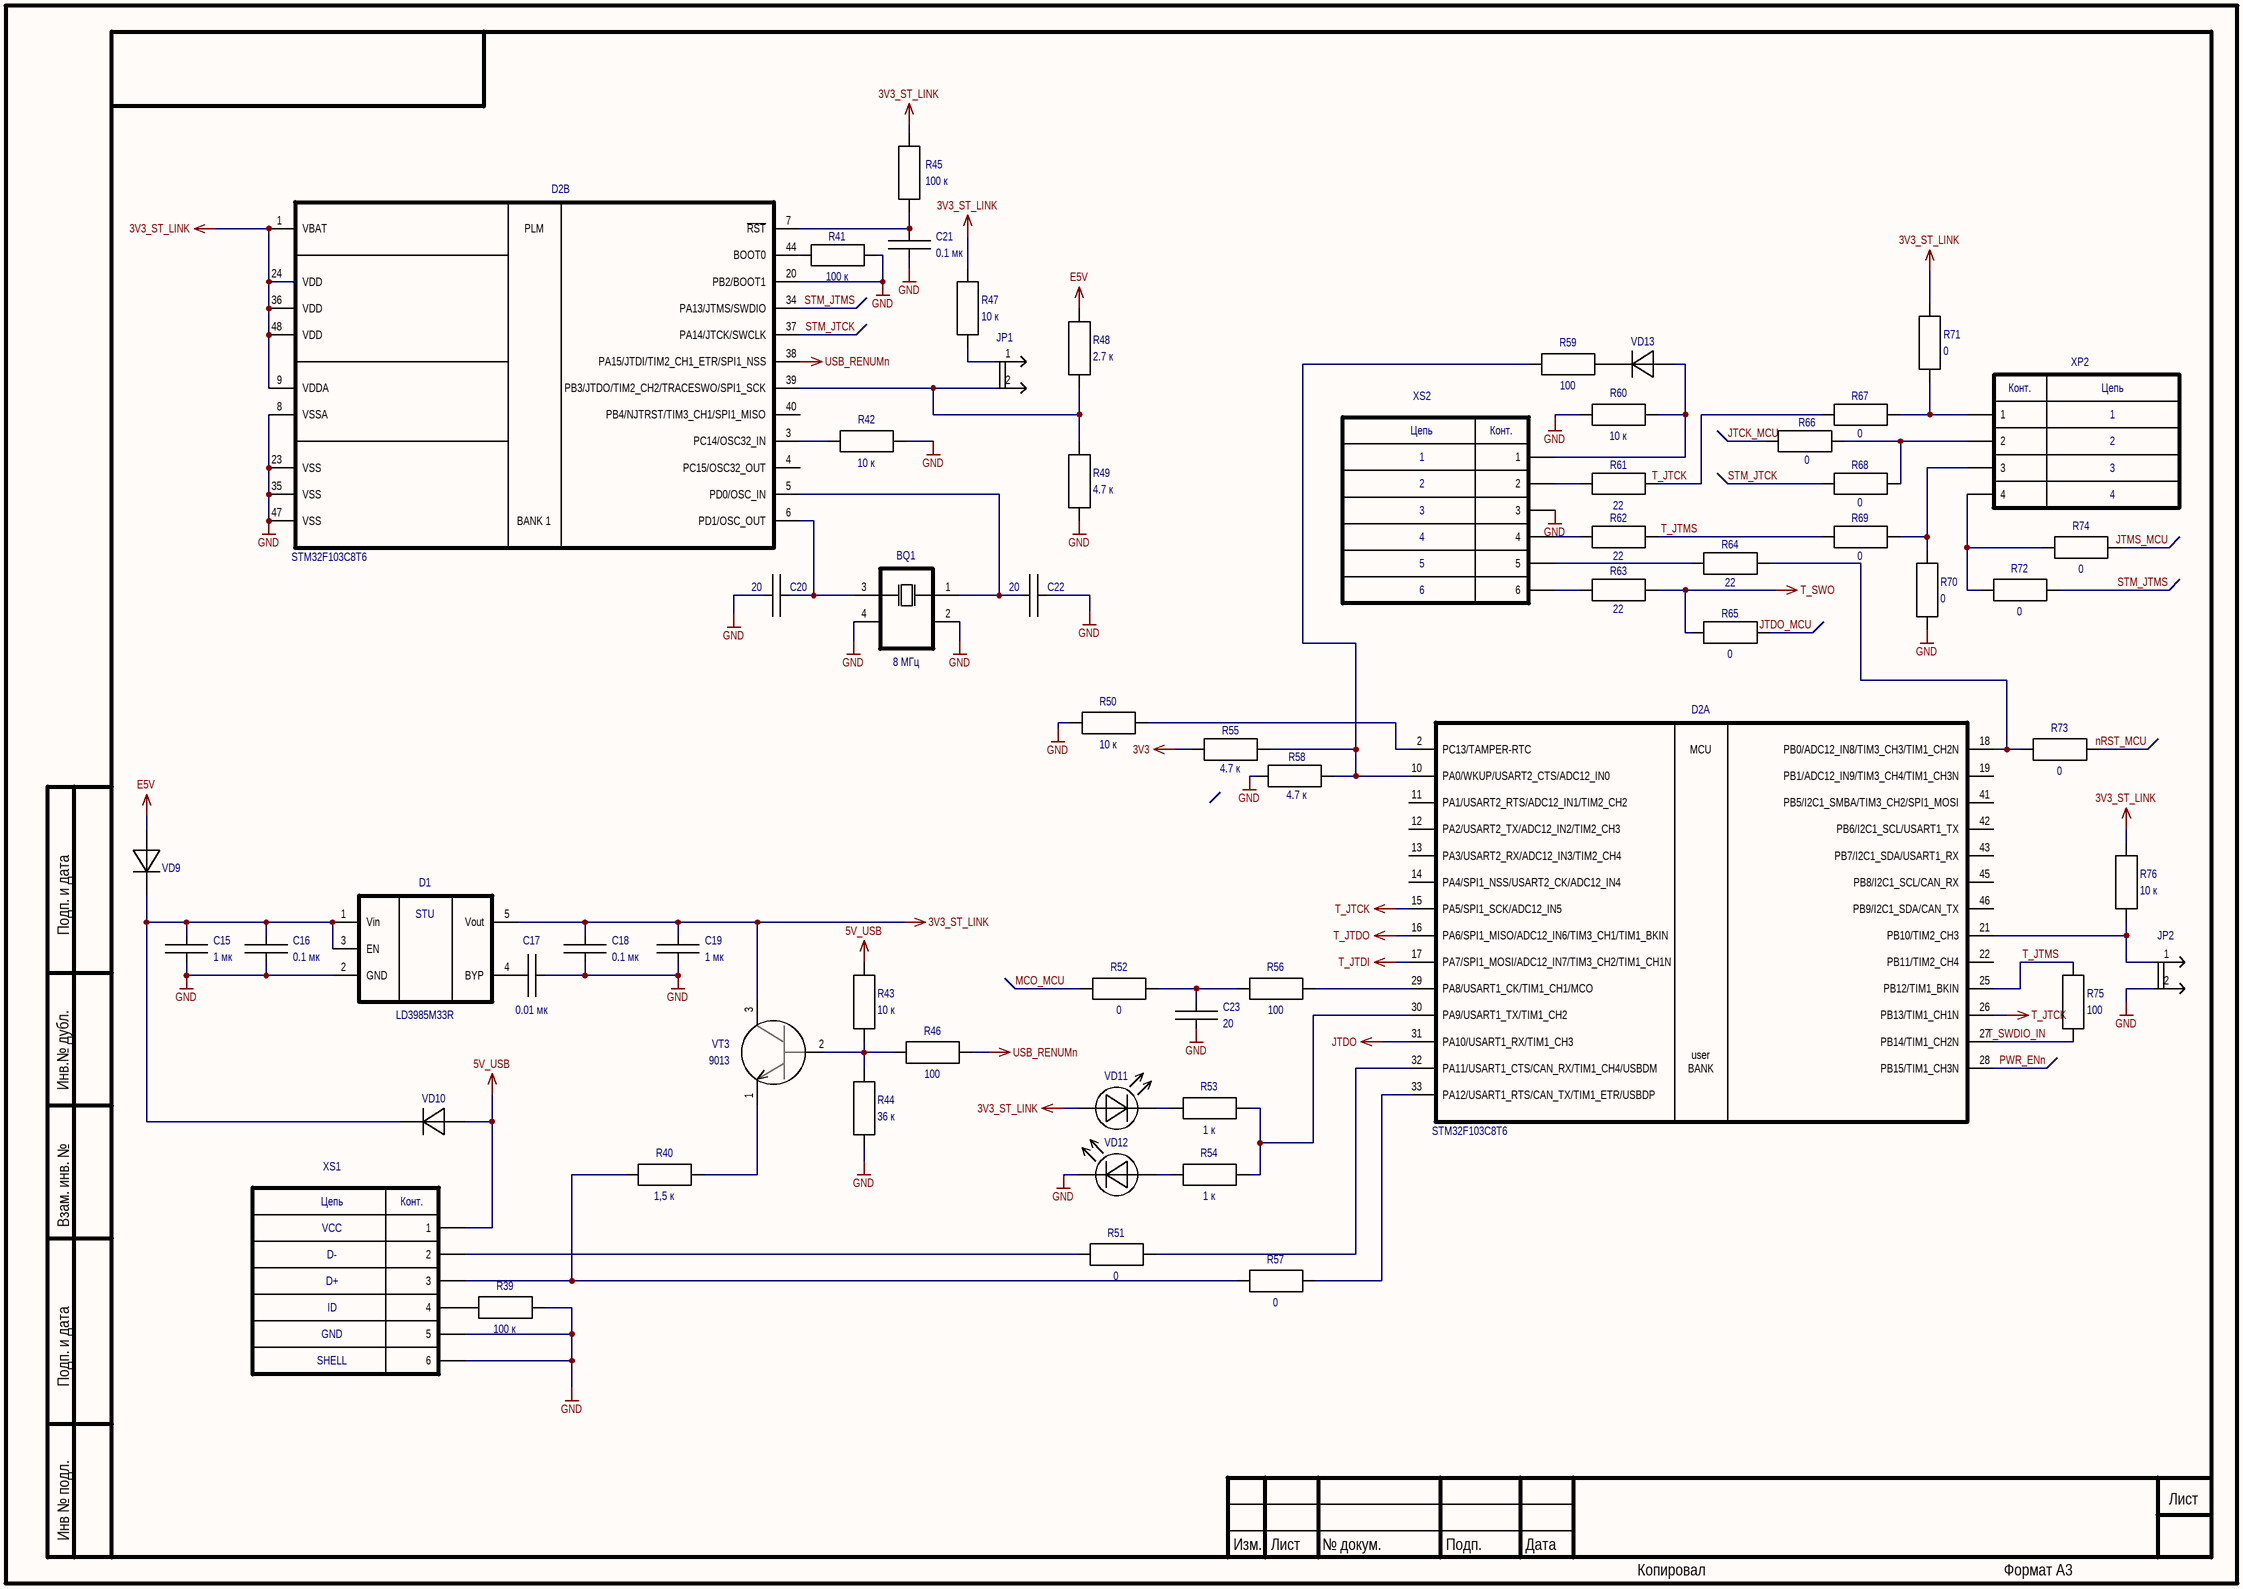
[diagram p4: программатор_мк.SchDoc]

### Parts
BQ1  value 8 МГц  [SMD3225_4P20MHZ20PF10PPM]  (hidden comment: кварцевый резонатор_1)
C15  value 1 мк  [K10-79_1.6_0.8(0603)]  (hidden comment: 1 мкФ ±* * * *, *)
C16  value 0.1 мк  [K10-79_1.6_0.8(0603)]  (hidden comment: 0.1 мкФ ±* * * *, *)
C17  value 0.01 мк  [K10-79_1.6_0.8(0603)]  (hidden comment: 0.01 мкФ ±* * * *, *)
C18  value 0.1 мк  [K10-79_1.6_0.8(0603)]  (hidden comment: 0.1 мкФ ±* * * *, *)
C19  value 1 мк  [K10-79_1.6_0.8(0603)]  (hidden comment: 1 мкФ ±* * * *, *)
C20  value 20  [K10-79_1.6_0.8(0603)]  (hidden comment: 20Ф ±* * * *, *)
C21  value 0.1 мк  [K10-79_1.6_0.8(0603)]  (hidden comment: 0.1 мкФ ±* * * *, *)
C22  value 20  [K10-79_1.6_0.8(0603)]  (hidden comment: 20Ф ±* * * *, *)
C23  value 20  [K10-79_1.6_0.8(0603)]  (hidden comment: 20Ф ±* * * *, *)
D1  value LD3985M33R  [SOT-23-5]  (hidden comment: LT1761ES5-2.5 (TSOT-23) Linear Technology)
D2  value STM32F103C8T6  [LQFP48]  (parts A,B of 2)
JP1  * (*) *  (value not drawn)
JP2  * (*) *  (value not drawn)
R39  value 100 к  [RES 0603]
R40  value 1,5 к  [RES 0603]
R41  value 100 к  [RES 0603]
R42  value 10 к  [RES 0603]
R43  value 10 к  [RES 0603]
R44  value 36 к  [RES 0603]
R45  value 100 к  [RES 0603]
R46  value 100  [RES 0603]
R47  value 10 к  [RES 0603]
R48  value 2.7 к  [RES 0603]
R49  value 4.7 к  [RES 0603]
R50  value 10 к  [RES 0603]
R51  value 0  [RES 0603]
R52  value 0  [RES 0603]
R53  value 1 к  [RES 0603]
R54  value 1 к  [RES 0603]
R55  value 4.7 к  [RES 0603]
R56  value 100  [RES 0603]
R57  value 0  [RES 0603]
R58  value 4.7 к  [RES 0603]
R59  value 100  [RES 0603]
R60  value 10 к  [RES 0603]
R61  value 22  [RES 0603]
R62  value 22  [RES 0603]
R63  value 22  [RES 0603]
R64  value 22  [RES 0603]
R65  value 0  [RES 0603]
R66  value 0  [RES 0603]
R67  value 0  [RES 0603]
R68  value 0  [RES 0603]
R69  value 0  [RES 0603]
R70  value 0  [RES 0603]
R71  value 0  [RES 0603]
R72  value 0  [RES 0603]
R73  value 0  [RES 0603]
R74  value 0  [RES 0603]
R75  value 100  [RES 0603]
R76  value 10 к  [RES 0603]
VD9  BAS316  [SOD-323]  (value not drawn)
VD10  BAS316  [SOD323]  (value not drawn)
VD11  Светодиод  [LED 0603]  (value not drawn)
VD12  Светодиод  [LED 0603]  (value not drawn)
VD13  BAS316  [SOD-323]  (value not drawn)
VT3  value 9013  [SOT23(KT-46)]  (hidden comment: BC847C (SOT-23) NXP)
XP2  KONT_POLE_4  [PLS-4]  (value not drawn)
XS1  1: VCC  3: D+  2: D-  4: ID  6: SHELL  5: GND  [MICRO_USB]  (hidden comment: KONT_POLE_USB_DBG)
XS2  KONT_POLE_USB_DBG  [PBS-6]  (value not drawn)

### Nets
3V3: R55.1
3V3_ST_LINK: C18.2 C19.2 D1.5(Vout) D2.1(VBAT) D2.9(VDDA) D2.24(VDD) D2.36(VDD) D2.48(VDD) R45.2 R47.1 R71.1 R76.1 VD11.1(A) VT3.3
5V_USB: R43.1 VD10.1 XS1.1
E5V: R48.1 VD9.1
GND: BQ1.2(GND) BQ1.4(GND) C15.1 C16.1 C17.1 C18.1 C19.1 C20.2 C21.1 C22.1 C23.2 D1.2(GND) D2.8(VSSA) D2.20(PB2/BOOT1) D2.23(VSS) D2.35(VSS) D2.47(VSS) JP2.2 R39.2 R41.2 R42.1 R44.2 R49.2 R50.1 R58.1 R60.2 R70.2 VD12.2(C) XS1.5 XS1.6 XS2.3
JTDO: D2.31(PA10/USART1_RX/TIM1_CH3)
T_JTCK: D2.15(PA5/SPI1_SCK/ADC12_IN5) D2.26(PB13/TIM1_CH1N) R61.2 R67.2
T_JTDI: D2.17(PA7/SPI1_MOSI/ADC12_IN7/TIM3_CH2/TIM1_CH1N)
T_JTDO: D2.16(PA6/SPI1_MISO/ADC12_IN6/TIM3_CH1/TIM1_BKIN)
T_SWO: R63.2 R65.1
USB_RENUMn: D2.38(PA15/JTDI/TIM2_CH1_ETR/SPI1_NSS) R46.2
JTCK_MCU: R66.1
JTDO_MCU: R65.2
JTMS_MCU: R74.1
MCO_MCU: R52.1
nRST_MCU: R73.2
PWR_ENn: D2.28(PB15/TIM1_CH3N)
STM_JTCK: D2.37(PA14/JTCK/SWCLK) R68.2
STM_JTMS: D2.34(PA13/JTMS/SWDIO) R72.1
T_JTMS: D2.25(PB12/TIM1_BKIN) R62.2 R69.1 R75.1
T_SWDIO_IN: D2.27(PB14/TIM1_CH2N) R75.2
NetBQ1_1: BQ1.1 C22.2 D2.5(PD0/OSC_IN)
NetBQ1_3: BQ1.3 C20.1 D2.6(PD1/OSC_OUT)
NetC15_2: C15.2 C16.2 D1.1(Vin) D1.3(EN) VD9.2 VD10.2
NetC17_2: C17.2 D1.4(BYP)
NetC21_2: C21.2 D2.7(~{RST}) R45.1
NetC23_1: C23.1 R52.2 R56.1
NetD2_2: D2.2(PC13/TAMPER-RTC) R50.2
NetD2_3: D2.3(PC14/OSC32_IN) R42.2
NetD2_10: D2.10(PA0/WKUP/USART2_CTS/ADC12_IN0) R55.2 R58.2 R59.2
NetD2_18: D2.18(PB0/ADC12_IN8/TIM3_CH3/TIM1_CH2N) R64.2 R73.1
NetD2_21: D2.21(PB10/TIM2_CH3) JP2.1 R76.2
NetD2_29: D2.29(PA8/USART1_CK/TIM1_CH1/MCO) R56.2
NetD2_30: D2.30(PA9/USART1_TX/TIM1_CH2) R53.2 R54.2
NetD2_32: D2.32(PA11/USART1_CTS/CAN_RX/TIM1_CH4/USBDM) R51.2
NetD2_33: D2.33(PA12/USART1_RTS/CAN_TX/TIM1_ETR/USBDP) R57.2
NetD2_39: D2.39(PB3/JTDO/TIM2_CH2/TRACESWO/SPI1_SCK) JP1.2 R48.2 R49.1
NetD2_44: D2.44(BOOT0) R41.1
NetJP1_1: JP1.1 R47.2
NetR39_1: R39.1 XS1.4
NetR40_1: R40.1 R57.1 XS1.3
NetR40_2: R40.2 VT3.1
NetR43_2: R43.2 R44.1 R46.1 VT3.2
NetR51_1: R51.1 XS1.2
NetR53_1: R53.1 VD11.2(C)
NetR54_1: R54.1 VD12.1(A)
NetR59_1: R59.1 VD13.2
NetR60_1: R60.1 VD13.1 XS2.1
NetR61_1: R61.1 XS2.2
NetR62_1: R62.1 XS2.4
NetR63_1: R63.1 XS2.6
NetR64_1: R64.1 XS2.5
NetR66_2: R66.2 R68.1 XP2.2
NetR67_1: R67.1 R71.2 XP2.1
NetR69_2: R69.2 R70.1 XP2.3
NetR72_2: R72.2 R74.2 XP2.4

Not connected (* = marked no-connect by the designer): D2 4(PC15/OSC32_OUT) 11(PA1/USART2_RTS/ADC12_IN1/TIM2_CH2) 12(PA2/USART2_TX/ADC12_IN2/TIM2_CH3) 13(PA3/USART2_RX/ADC12_IN3/TIM2_CH4) 14(PA4/SPI1_NSS/USART2_CK/ADC12_IN4) 19(PB1/ADC12_IN9/TIM3_CH4/TIM1_CH3N) 22(PB11/TIM2_CH4) 40(PB4/NJTRST/TIM3_CH1/SPI1_MISO) 41(PB5/I2C1_SMBA/TIM3_CH2/SPI1_MOSI) 42(PB6/I2C1_SCL/USART1_TX) 43(PB7/I2C1_SDA/USART1_RX) 45(PB8/I2C1_SCL/CAN_RX) 46(PB9/I2C1_SDA/CAN_TX)

### Notes on the sheet
- Подп. и дата
- Инв.№ дубл.
- Взам. инв. №
- Инв № подл.
- Изм.
- Лист
- № докум.
- Подп.
- Дата
- Копировал
- Формат А3
- (in symbol KONT_POLE_4) Конт.; Цепь
- (in symbol KONT_POLE_USB_DBG) Цепь; Конт.
- (in symbol LD3985M33R) STU
- (in symbol stm32f103c8t6, part A) MCU; user; BANK
- (in symbol stm32f103c8t6, part B) PLM; BANK 1

### Library data of the parts
BQ1 = кварцевый резонатор_1: PartNumber: MQ-12.000-18; Company: Mercury; Package: 0705
C15-C23 = C: Company: *; PartNumber: *; Tolerance: *; Voltage: *; Type: *; Package: *
D1 = LD3985M33R: Company: Linear Technology; PartNumber: LT1761ES5-2.5; Package: TSOT-23
D2 = stm32f103c8t6: Company: Xilinx; PurtNamber: XC6SLX25-2FGG484C; Package: LQFP-48
JP1 JP2 = JP2_vertical: Company: *; PartNumber: *; Package: *; Value: *
R39-R42 R45 R46 R50-R69 R72-R74 = R: Company: *; PartNumber: *; Package: *; Tolerance: *
R43 R44 R47-R49 R70 R71 R75 R76 = R_1: Company: *; PartNumber: *; Package: *; Tolerance: *
VD9 VD10 VD13 = BAS316: Company: NXP; PartNumber: BAS316; Package: SOD-323; Value: BAS316
VT3 = T!9013: Package: SOT-23; PartNumber: BC847C; Company: NXP
XP2 = KONT_POLE_4: 1: 1; 2: 2; 3: 3; 4: 4
XS1 XS2 = KONT_POLE_USB_DBG
  XS2: 1: 1; 3: 3; 2: 2; 4: 4; 6: 6; 5: 5

## Sheet программатор_ПЛИС.SchDoc
size 420 x 297 mm; SheetNumber: 6; SheetTotal: 6
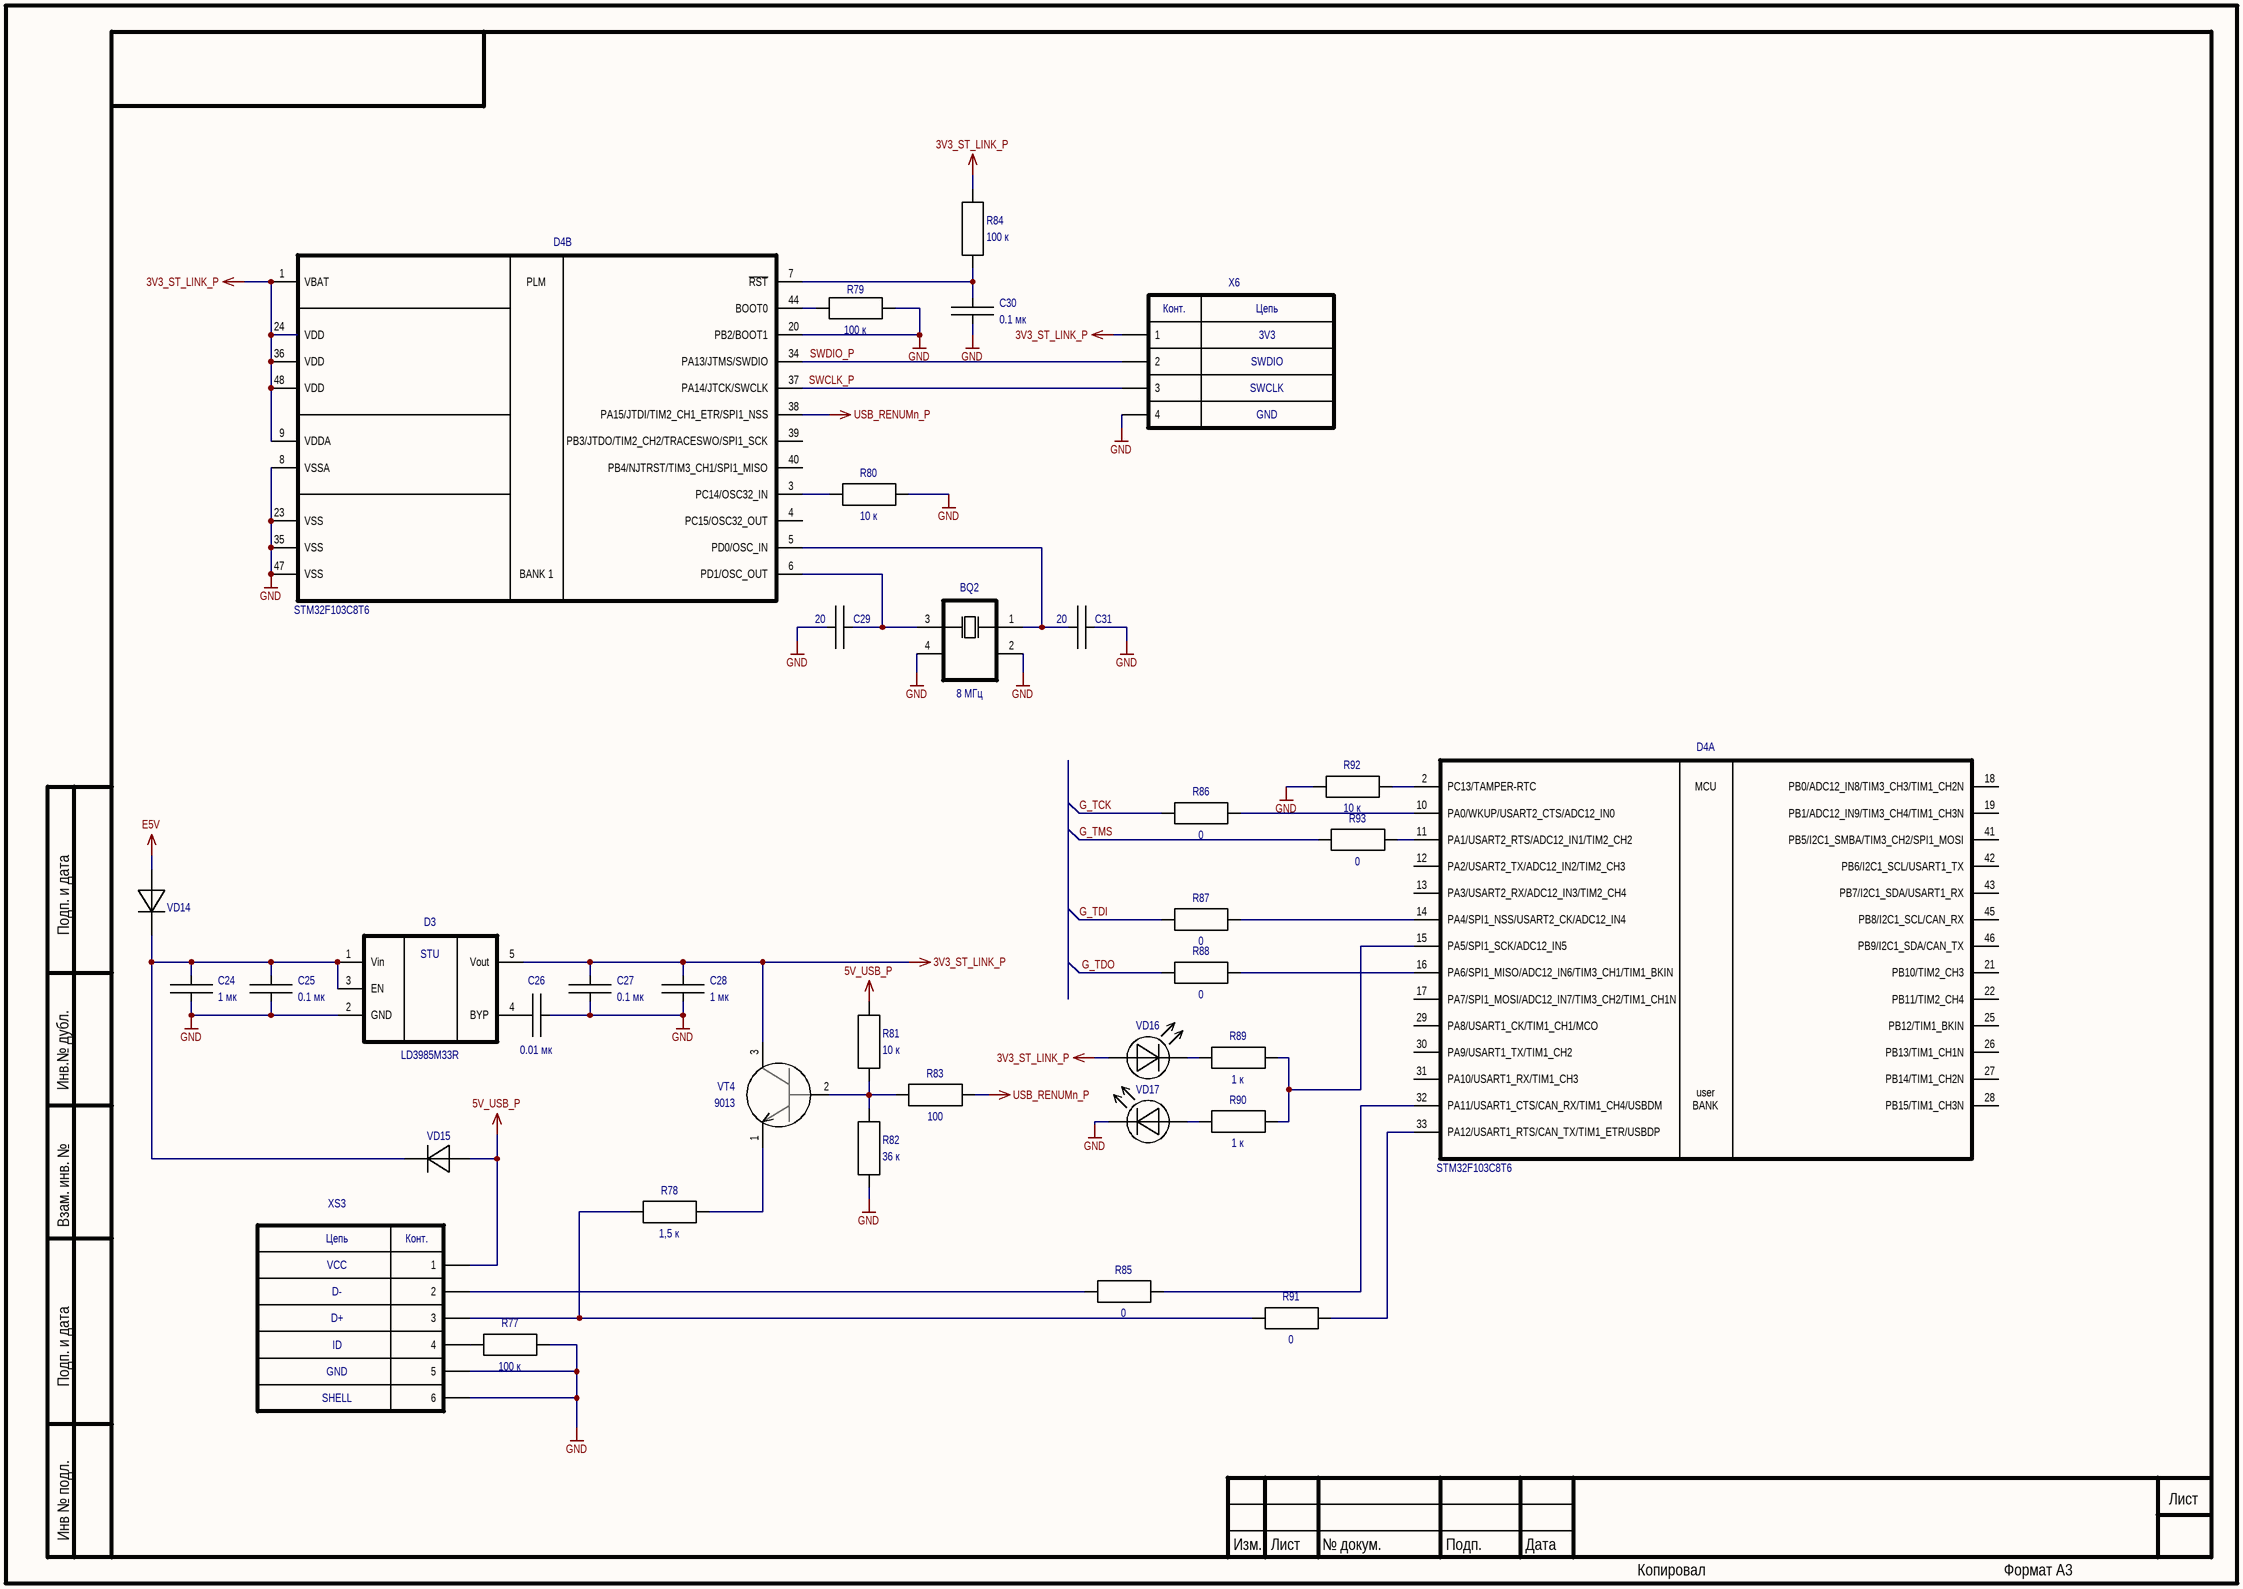
[diagram p5: программатор_ПЛИС.SchDoc]

### Parts
BQ2  value 8 МГц  [SMD3225_4P20MHZ20PF10PPM]  (hidden comment: кварцевый резонатор_1)
C24  value 1 мк  (hidden comment: 1 мкФ ±* * * *, *)
C25  value 0.1 мк  (hidden comment: 0.1 мкФ ±* * * *, *)
C26  value 0.01 мк  [K10-79_1.6_0.8(0603)]  (hidden comment: 0.01 мкФ ±* * * *, *)
C27  value 0.1 мк  (hidden comment: 0.1 мкФ ±* * * *, *)
C28  value 1 мк  (hidden comment: 1 мкФ ±* * * *, *)
C29  value 20  (hidden comment: 20Ф ±* * * *, *)
C30  value 0.1 мк  (hidden comment: 0.1 мкФ ±* * * *, *)
C31  value 20  (hidden comment: 20Ф ±* * * *, *)
D3  value LD3985M33R  [SOT-23-5]  (hidden comment: LT1761ES5-2.5 (TSOT-23) Linear Technology)
D4  value STM32F103C8T6  [LQFP48]  (parts A,B of 2)
R77  value 100 к
R78  value 1,5 к
R79  value 100 к
R80  value 10 к
R81  value 10 к
R82  value 36 к
R83  value 100
R84  value 100 к  [RES 0603]
R85  value 0
R86  value 0
R87  value 0
R88  value 0
R89  value 1 к
R90  value 1 к
R91  value 0
R92  value 10 к
R93  value 0
VD14  BAS316  [SOD323]  (value not drawn)
VD15  BAS316  [SOD-323]  (value not drawn)
VD16  Светодиод  [LED 0603]  (value not drawn)
VD17  Светодиод  [LED 0603]  (value not drawn)
VT4  value 9013  [SOT23(KT-46)]  (hidden comment: BC847C (SOT-23) NXP)
X6  1: 3V3  2: SWDIO  3: SWCLK  4: GND  (hidden comment: KONT_POLE_4)
XS3  1: VCC  3: D+  2: D-  4: ID  6: SHELL  5: GND  [micro_USB]  (hidden comment: KONT_POLE_USB_DBG)

### Nets
3V3_ST_LINK_P: C27.2 C28.2 D3.5(Vout) D4.1(VBAT) D4.9(VDDA) D4.24(VDD) D4.36(VDD) D4.48(VDD) R84.1 VD16.1(A) VT4.3 X6.1
5V_USB_P: R81.1 VD15.1 XS3.1
E5V: VD14.1
GND: BQ2.2(GND) BQ2.4(GND) C24.1 C25.1 C26.1 C27.1 C28.1 C29.2 C30.2 C31.1 D3.2(GND) D4.8(VSSA) D4.20(PB2/BOOT1) D4.23(VSS) D4.35(VSS) D4.47(VSS) R77.2 R79.2 R80.1 R82.2 R92.1 VD17.2(C) X6.4 XS3.5 XS3.6
USB_RENUMn_P: D4.38(PA15/JTDI/TIM2_CH1_ETR/SPI1_NSS) R83.2
G_TCK: R86.1
G_TDI: R87.1
G_TDO: R88.1
G_TMS: R93.1
SWCLK_P: D4.37(PA14/JTCK/SWCLK) X6.3
SWDIO_P: D4.34(PA13/JTMS/SWDIO) X6.2
NetBQ2_1: BQ2.1 C31.2 D4.5(PD0/OSC_IN)
NetBQ2_3: BQ2.3 C29.1 D4.6(PD1/OSC_OUT)
NetC24_2: C24.2 C25.2 D3.1(Vin) D3.3(EN) VD14.2 VD15.2
NetC26_2: C26.2 D3.4(BYP)
NetC30_1: C30.1 D4.7(~{RST}) R84.2
NetD4_2: D4.2(PC13/TAMPER-RTC) R92.2
NetD4_3: D4.3(PC14/OSC32_IN) R80.2
NetD4_10: D4.10(PA0/WKUP/USART2_CTS/ADC12_IN0) R86.2
NetD4_11: D4.11(PA1/USART2_RTS/ADC12_IN1/TIM2_CH2) R93.2
NetD4_14: D4.14(PA4/SPI1_NSS/USART2_CK/ADC12_IN4) R87.2
NetD4_15: D4.15(PA5/SPI1_SCK/ADC12_IN5) R89.2 R90.2
NetD4_16: D4.16(PA6/SPI1_MISO/ADC12_IN6/TIM3_CH1/TIM1_BKIN) R88.2
NetD4_32: D4.32(PA11/USART1_CTS/CAN_RX/TIM1_CH4/USBDM) R85.2
NetD4_33: D4.33(PA12/USART1_RTS/CAN_TX/TIM1_ETR/USBDP) R91.2
NetD4_44: D4.44(BOOT0) R79.1
NetR77_1: R77.1 XS3.4
NetR78_1: R78.1 R91.1 XS3.3
NetR78_2: R78.2 VT4.1
NetR81_2: R81.2 R82.1 R83.1 VT4.2
NetR85_1: R85.1 XS3.2
NetR89_1: R89.1 VD16.2(C)
NetR90_1: R90.1 VD17.1(A)

Not connected (* = marked no-connect by the designer): D4 4(PC15/OSC32_OUT) 12(PA2/USART2_TX/ADC12_IN2/TIM2_CH3) 13(PA3/USART2_RX/ADC12_IN3/TIM2_CH4) 17(PA7/SPI1_MOSI/ADC12_IN7/TIM3_CH2/TIM1_CH1N) 18(PB0/ADC12_IN8/TIM3_CH3/TIM1_CH2N) 19(PB1/ADC12_IN9/TIM3_CH4/TIM1_CH3N) 21(PB10/TIM2_CH3) 22(PB11/TIM2_CH4) 25(PB12/TIM1_BKIN) 26(PB13/TIM1_CH1N) 27(PB14/TIM1_CH2N) 28(PB15/TIM1_CH3N) 29(PA8/USART1_CK/TIM1_CH1/MCO) 30(PA9/USART1_TX/TIM1_CH2) 31(PA10/USART1_RX/TIM1_CH3) 39(PB3/JTDO/TIM2_CH2/TRACESWO/SPI1_SCK) 40(PB4/NJTRST/TIM3_CH1/SPI1_MISO) 41(PB5/I2C1_SMBA/TIM3_CH2/SPI1_MOSI) 42(PB6/I2C1_SCL/USART1_TX) 43(PB7/I2C1_SDA/USART1_RX) 45(PB8/I2C1_SCL/CAN_RX) 46(PB9/I2C1_SDA/CAN_TX)

### Notes on the sheet
- Подп. и дата
- Инв.№ дубл.
- Взам. инв. №
- Инв № подл.
- Изм.
- Лист
- № докум.
- Подп.
- Дата
- Копировал
- Формат А3
- (in symbol KONT_POLE_4) Конт.; Цепь
- (in symbol KONT_POLE_USB_DBG) Цепь; Конт.
- (in symbol LD3985M33R) STU
- (in symbol stm32f103c8t6, part A) MCU; user; BANK
- (in symbol stm32f103c8t6, part B) PLM; BANK 1

### Library data of the parts
BQ2 = кварцевый резонатор_1: as BQ1 on sheet программатор_мк; Package: 0705
C24-C31 = C: Company: *; PartNumber: *; Tolerance: *; Voltage: *; Type: *; Package: *
D3 = LD3985M33R: Company: Linear Technology; PartNumber: LT1761ES5-2.5; Package: TSOT-23
D4 = stm32f103c8t6: as D2 on sheet программатор_мк; Package: LQFP-48
R77-R80 R83 R85-R93 = R: Company: *; PartNumber: *; Package: *; Tolerance: *
R81 R82 R84 = R_1: Company: *; PartNumber: *; Package: *; Tolerance: *
VD14 VD15 = BAS316: Company: NXP; PartNumber: BAS316; Package: SOD-323; Value: BAS316
VT4 = T!9013: Package: SOT-23; PartNumber: BC847C; Company: NXP

## Nets that join several sheets
3V3: служебный (6 pins), мезанин (X3.B10 X3.B11), GPIO_mcu_plis (X5.1 X5.75 X5.76), периферия (19 pins), программатор_мк (R55.1)
E5V: программатор_мк (R48.1 VD9.1), программатор_ПЛИС (VD14.1)
GND: служебный (7 pins), мезанин (30 pins), GPIO_mcu_plis (6 pins), периферия (42 pins), программатор_мк (31 pins), программатор_ПЛИС (25 pins)
AN_0: GPIO_mcu_plis (X4.38), периферия (R35.2)
AN_1: GPIO_mcu_plis (X4.35), периферия (R36.2)
AN_2: GPIO_mcu_plis (X4.32), периферия (R37.2)
AN_3: GPIO_mcu_plis (X4.29), периферия (R38.2)
BOOT0_MCU: служебный (R6.2 R7.1), мезанин (X2.A9)
BOOT1_MCU: служебный (R4.2 R8.1), мезанин (X2.A39)
BTN_C: GPIO_mcu_plis (X4.47), периферия (C14.2 R25.1 S6.1)
BTN_D: GPIO_mcu_plis (X4.53), периферия (C13.2 R24.1 S5.1)
BTN_L: GPIO_mcu_plis (X4.44), периферия (C10.2 R21.1 S2.1)
BTN_R: GPIO_mcu_plis (X4.50), периферия (C12.2 R23.1 S4.1)
BTN_U: GPIO_mcu_plis (X4.41), периферия (C11.2 R22.1 S3.1)
CA: GPIO_mcu_plis (X4.5), периферия (R33.1)
CB: GPIO_mcu_plis (X4.8), периферия (R33.2)
CC: GPIO_mcu_plis (X4.11), периферия (R33.3)
CD: GPIO_mcu_plis (X4.14), периферия (R33.4)
CE: GPIO_mcu_plis (X4.17), периферия (R34.1)
CF: GPIO_mcu_plis (X4.20), периферия (R34.2)
CG: GPIO_mcu_plis (X4.23), периферия (R34.3)
DP: GPIO_mcu_plis (X4.26), периферия (R34.4)
G_TCK: служебный (R5.1 X1.1), мезанин (X3.A25), программатор_ПЛИС (R86.1)
G_TDI: служебный (X1.9), мезанин (X3.B25), программатор_ПЛИС (R87.1)
G_TDO: служебный (R1.2 X1.3), мезанин (X3.B24), программатор_ПЛИС (R88.1)
G_TMS: служебный (R3.2 X1.5), мезанин (X3.A24), программатор_ПЛИС (R93.1)
JTCK_MCU: мезанин (X2.B19), программатор_мк (R66.1)
JTDO_MCU: мезанин (X2.A12), программатор_мк (R65.2)
JTMS_MCU: мезанин (X2.B20), программатор_мк (R74.1)
LDB_0: GPIO_mcu_plis (X4.89), периферия (R32.1)
LDB_1: GPIO_mcu_plis (X4.80), периферия (R31.1)
LDG_0: GPIO_mcu_plis (X4.92), периферия (R32.2)
LDG_1: GPIO_mcu_plis (X4.83), периферия (R31.2)
LDR_0: GPIO_mcu_plis (X4.95), периферия (R32.3)
LDR_1: GPIO_mcu_plis (X4.86), периферия (R31.3)
LEDB_0: GPIO_mcu_plis (X4.56), периферия (R9.1)
LEDB_1: GPIO_mcu_plis (X4.59), периферия (R9.2)
LEDB_2: GPIO_mcu_plis (X4.62), периферия (R9.3)
LEDB_3: GPIO_mcu_plis (X4.65), периферия (R9.4)
LEDB_4: GPIO_mcu_plis (X4.68), периферия (R10.1)
LEDB_5: GPIO_mcu_plis (X4.71), периферия (R10.2)
LEDB_6: GPIO_mcu_plis (X4.74), периферия (R10.3)
LEDB_7: GPIO_mcu_plis (X4.77), периферия (R10.4)
MCO_MCU: мезанин (X2.B1), GPIO_mcu_plis (X5.69), программатор_мк (R52.1)
nRST_MCU: служебный (C1.2 R2.2 S1.1), мезанин (X2.A49), программатор_мк (R73.2)
PA0: мезанин (X2.B46), GPIO_mcu_plis (X4.97)
PA1: мезанин (X2.A46), GPIO_mcu_plis (X4.4)
PA2: мезанин (X2.A45), GPIO_mcu_plis (X4.7)
PA3: мезанин (X2.B45), GPIO_mcu_plis (X4.100)
PA4: мезанин (X2.B44), GPIO_mcu_plis (X4.103)
PA5: мезанин (X2.A43), GPIO_mcu_plis (X4.10)
PA6: мезанин (X2.B43), GPIO_mcu_plis (X4.106)
PA7: мезанин (X2.A42), GPIO_mcu_plis (X4.13)
PA8: мезанин (X2.B23), GPIO_mcu_plis (X5.35)
PA9: мезанин (X2.A22), GPIO_mcu_plis (X4.52)
PA10: мезанин (X2.A21), GPIO_mcu_plis (X4.55)
PA11: мезанин (X2.B22), GPIO_mcu_plis (X5.37)
PA12: мезанин (X2.B21), GPIO_mcu_plis (X5.39)
PB0: мезанин (X2.A40), GPIO_mcu_plis (X4.16)
PB1: мезанин (X2.B40), GPIO_mcu_plis (X4.115)
PB5: мезанин (X2.B11), GPIO_mcu_plis (X5.55)
PB6: мезанин (X2.A10), GPIO_mcu_plis (X4.70)
PB7: мезанин (X2.B10), GPIO_mcu_plis (X5.57)
PB8: мезанин (X2.A8), GPIO_mcu_plis (X4.73)
PB9: мезанин (X2.B9), GPIO_mcu_plis (X5.59)
PB10: мезанин (X2.B34), GPIO_mcu_plis (X5.13)
PB11: мезанин (X2.A34), GPIO_mcu_plis (X4.31)
PB12: мезанин (X2.A33), GPIO_mcu_plis (X4.34)
PB13: мезанин (X2.B33), GPIO_mcu_plis (X5.15)
PB14: мезанин (X2.B32), GPIO_mcu_plis (X5.17)
PB15: мезанин (X2.A32), GPIO_mcu_plis (X4.37)
PC0: мезанин (X2.B49), GPIO_mcu_plis (X4.88)
PC1: мезанин (X2.B48), GPIO_mcu_plis (X4.91)
PC2: мезанин (X2.A48), GPIO_mcu_plis (X4.1)
PC3: мезанин (X2.B47), GPIO_mcu_plis (X4.93)
PC4: мезанин (X2.B42), GPIO_mcu_plis (X4.109)
PC5: мезанин (X2.B41), GPIO_mcu_plis (X4.112)
PC6: мезанин (X2.B26), GPIO_mcu_plis (X5.29)
PC7: мезанин (X2.B25), GPIO_mcu_plis (X5.31)
PC8: мезанин (X2.A24), GPIO_mcu_plis (X4.49)
PC9: мезанин (X2.B24), GPIO_mcu_plis (X5.33)
PC10: мезанин (X2.B18), GPIO_mcu_plis (X5.41)
PC11: мезанин (X2.A17), GPIO_mcu_plis (X4.58)
PC12: мезанин (X2.B17), GPIO_mcu_plis (X5.43)
PC13: мезанин (X2.A1), GPIO_mcu_plis (X4.85)
PD0: мезанин (X2.A16), GPIO_mcu_plis (X4.61)
PD1: мезанин (X2.B16), GPIO_mcu_plis (X5.45)
PD2: мезанин (X2.B15), GPIO_mcu_plis (X5.47)
PD3: мезанин (X2.A15), GPIO_mcu_plis (X4.64)
PD4: мезанин (X2.B14), GPIO_mcu_plis (X5.49)
PD5: мезанин (X2.B13), GPIO_mcu_plis (X5.51)
PD6: мезанин (X2.A13), GPIO_mcu_plis (X4.67)
PD7: мезанин (X2.B12), GPIO_mcu_plis (X5.53)
PD8: мезанин (X2.B31), GPIO_mcu_plis (X5.19)
PD9: мезанин (X2.A31), GPIO_mcu_plis (X4.40)
PD10: мезанин (X2.B30), GPIO_mcu_plis (X5.21)
PD11: мезанин (X2.B29), GPIO_mcu_plis (X5.23)
PD12: мезанин (X2.A28), GPIO_mcu_plis (X4.43)
PD13: мезанин (X2.B28), GPIO_mcu_plis (X5.25)
PD14: мезанин (X2.B27), GPIO_mcu_plis (X5.27)
PD15: мезанин (X2.A26), GPIO_mcu_plis (X4.46)
PE0: мезанин (X2.B8), GPIO_mcu_plis (X5.61)
PE1: мезанин (X2.B7), GPIO_mcu_plis (X5.63)
PE2: мезанин (X2.A4), GPIO_mcu_plis (X4.76)
PE3: мезанин (X2.A3), GPIO_mcu_plis (X4.79)
PE4: мезанин (X2.B3), GPIO_mcu_plis (X5.65)
PE5: мезанин (X2.A2), GPIO_mcu_plis (X4.82)
PE6: мезанин (X2.B2), GPIO_mcu_plis (X5.67)
PE7: мезанин (X2.A38), GPIO_mcu_plis (X4.19)
PE8: мезанин (X2.B39), GPIO_mcu_plis (X4.118)
PE9: мезанин (X2.B38), GPIO_mcu_plis (X5.5)
PE10: мезанин (X2.A37), GPIO_mcu_plis (X4.22)
PE11: мезанин (X2.A36), GPIO_mcu_plis (X4.25)
PE12: мезанин (X2.B37), GPIO_mcu_plis (X5.7)
PE13: мезанин (X2.B36), GPIO_mcu_plis (X5.9)
PE14: мезанин (X2.B35), GPIO_mcu_plis (X5.11)
PE15: мезанин (X2.A35), GPIO_mcu_plis (X4.28)
PHOTO_R: GPIO_mcu_plis (X4.2), периферия (R11.1 R12.2)
PIN_1: мезанин (X3.B37), GPIO_mcu_plis (X5.30)
PIN_2: мезанин (X3.B36), GPIO_mcu_plis (X5.32)
PIN_3: мезанин (X3.A36), GPIO_mcu_plis (X4.30)
PIN_4: мезанин (X3.B35), GPIO_mcu_plis (X5.34)
PIN_5: мезанин (X3.A35), GPIO_mcu_plis (X4.33)
PIN_6: мезанин (X3.A34), GPIO_mcu_plis (X4.36)
PIN_7: мезанин (X3.B34), GPIO_mcu_plis (X5.36)
PIN_8: мезанин (X3.B33), GPIO_mcu_plis (X5.38)
PIN_12: мезанин (X3.B32), GPIO_mcu_plis (X5.40)
PIN_14: мезанин (X3.B31), GPIO_mcu_plis (X5.42)
PIN_15: мезанин (X3.A31), GPIO_mcu_plis (X4.39)
PIN_16: мезанин (X3.B30), GPIO_mcu_plis (X5.44)
PIN_17: мезанин (X3.B29), GPIO_mcu_plis (X5.46)
PIN_18: мезанин (X3.B28), GPIO_mcu_plis (X5.48)
PIN_19: мезанин (X3.B27), GPIO_mcu_plis (X5.50)
PIN_20: мезанин (X3.B26), GPIO_mcu_plis (X5.52)
PIN_21: мезанин (X3.A26), GPIO_mcu_plis (X4.42)
PIN_26: мезанин (X3.A23), GPIO_mcu_plis (X4.45)
PIN_27: мезанин (X3.B23), GPIO_mcu_plis (X5.54)
PIN_28: мезанин (X3.B22), GPIO_mcu_plis (X5.56)
PIN_29: мезанин (X3.B21), GPIO_mcu_plis (X5.58)
PIN_30: мезанин (X3.A21), GPIO_mcu_plis (X4.48)
PIN_33: мезанин (X3.A20), GPIO_mcu_plis (X4.51)
PIN_34: мезанин (X3.B20), GPIO_mcu_plis (X5.60)
PIN_35: мезанин (X3.B19), GPIO_mcu_plis (X5.62)
PIN_36: мезанин (X3.A18), GPIO_mcu_plis (X4.54)
PIN_37: мезанин (X3.B18), GPIO_mcu_plis (X5.64)
PIN_38: мезанин (X3.B17), GPIO_mcu_plis (X5.66)
PIN_39: мезанин (X3.A16), GPIO_mcu_plis (X4.57)
PIN_40: мезанин (X3.B16), GPIO_mcu_plis (X5.68)
PIN_41: мезанин (X3.A15), GPIO_mcu_plis (X4.60)
PIN_42: мезанин (X3.B15), GPIO_mcu_plis (X5.70)
PIN_43: мезанин (X3.B14), GPIO_mcu_plis (X5.71)
PIN_47: мезанин (X3.B13), GPIO_mcu_plis (X5.72)
PIN_48: мезанин (X3.A13), GPIO_mcu_plis (X4.63)
PIN_49: мезанин (X3.B12), GPIO_mcu_plis (X5.73)
PIN_50: мезанин (X3.A12), GPIO_mcu_plis (X4.66)
PIN_51: мезанин (X3.A9), GPIO_mcu_plis (X4.69)
PIN_52: мезанин (X3.B9), GPIO_mcu_plis (X4.120)
PIN_53: мезанин (X3.B8), GPIO_mcu_plis (X4.117)
PIN_54: мезанин (X3.A8), GPIO_mcu_plis (X4.72)
PIN_55: мезанин (X3.A7), GPIO_mcu_plis (X4.75)
PIN_56: мезанин (X3.B7), GPIO_mcu_plis (X4.114)
PIN_57: мезанин (X3.B6), GPIO_mcu_plis (X4.111)
PIN_58: мезанин (X3.A6), GPIO_mcu_plis (X4.78)
PIN_66: мезанин (X3.B5), GPIO_mcu_plis (X4.108)
PIN_67: мезанин (X3.A5), GPIO_mcu_plis (X4.81)
PIN_68: мезанин (X3.A4), GPIO_mcu_plis (X4.84)
PIN_69: мезанин (X3.B4), GPIO_mcu_plis (X4.105)
PIN_70: мезанин (X3.B3), GPIO_mcu_plis (X4.102)
PIN_71: мезанин (X3.A3), GPIO_mcu_plis (X4.87)
PIN_72: мезанин (X3.A2), GPIO_mcu_plis (X4.90)
PIN_73: мезанин (X3.B2), GPIO_mcu_plis (X4.99)
PIN_74: мезанин (X3.B1), GPIO_mcu_plis (X4.96)
PIN_75: мезанин (X3.A1), GPIO_mcu_plis (X4.94)
PIN_76: мезанин (X3.A49), GPIO_mcu_plis (X4.3)
PIN_77: мезанин (X3.B49), GPIO_mcu_plis (X5.6)
PIN_78: мезанин (X3.B48), GPIO_mcu_plis (X5.8)
PIN_81: мезанин (X3.A48), GPIO_mcu_plis (X4.6)
PIN_82: мезанин (X3.B47), GPIO_mcu_plis (X5.10)
PIN_83: мезанин (X3.A47), GPIO_mcu_plis (X4.9)
PIN_84: мезанин (X3.B46), GPIO_mcu_plis (X5.12)
PIN_85: мезанин (X3.A46), GPIO_mcu_plis (X4.12)
PIN_86: мезанин (X3.A45), GPIO_mcu_plis (X4.15)
PIN_87: мезанин (X3.B45), GPIO_mcu_plis (X5.14)
PIN_88: мезанин (X3.B44), GPIO_mcu_plis (X5.16)
PIN_89: мезанин (X3.A44), GPIO_mcu_plis (X4.18)
PIN_90: мезанин (X3.A43), GPIO_mcu_plis (X4.21)
PIN_91: мезанин (X3.B43), GPIO_mcu_plis (X5.18)
PIN_92: мезанин (X3.B42), GPIO_mcu_plis (X5.20)
PIN_95: мезанин (X3.A41), GPIO_mcu_plis (X4.24)
PIN_96: мезанин (X3.B41), GPIO_mcu_plis (X5.22)
PIN_97: мезанин (X3.A40), GPIO_mcu_plis (X4.27)
PIN_98: мезанин (X3.B40), GPIO_mcu_plis (X5.24)
PIN_99: мезанин (X3.B39), GPIO_mcu_plis (X5.26)
PIN_100: мезанин (X3.B38), GPIO_mcu_plis (X5.28)
SW_0: GPIO_mcu_plis (X4.119), периферия (C2.2 R13.2 SW1.2)
SW_1: GPIO_mcu_plis (X4.116), периферия (C4.2 R15.2 SW2.2)
SW_2: GPIO_mcu_plis (X4.113), периферия (C3.2 R14.2 SW3.2)
SW_3: GPIO_mcu_plis (X4.110), периферия (C5.2 R16.2 SW4.2)
SW_4: GPIO_mcu_plis (X4.107), периферия (C6.2 R17.2 SW5.2)
SW_5: GPIO_mcu_plis (X4.104), периферия (C8.2 R19.2 SW6.2)
SW_6: GPIO_mcu_plis (X4.101), периферия (C7.2 R18.2 SW7.2)
SW_7: GPIO_mcu_plis (X4.98), периферия (C9.2 R20.2 SW8.2)